# Altium project COMRAD_0v1.PrjPCB (part 4 of 5)

## Sheet Power_Distribution_TopLevel.SchDoc
size A4; DocumentNumber: 46; SheetNumber: 46; SheetTotal: 47
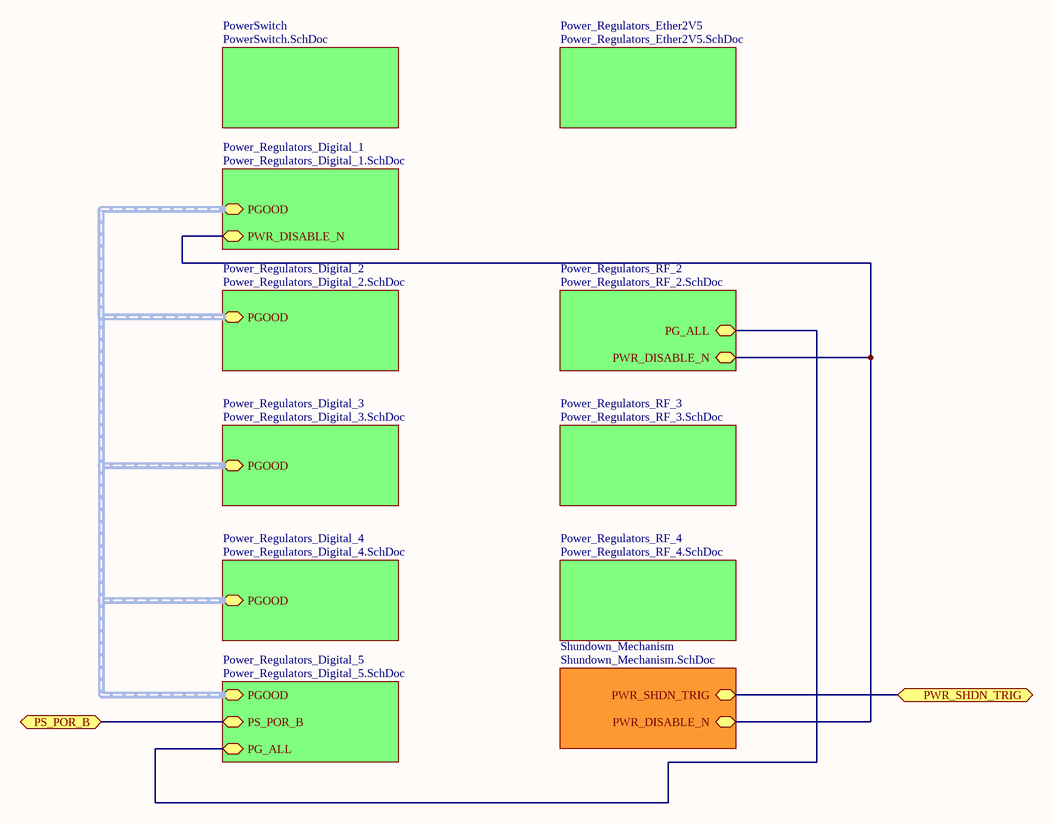
[diagram p30: Power_Distribution_TopLevel.SchDoc]

### Sub-sheets
Power_Regulators_Digital_1 = Power_Regulators_Digital_1.SchDoc: PGOOD (harness PGOOD), PWR_DISABLE_N (bidir)
Power_Regulators_Digital_2 = Power_Regulators_Digital_2.SchDoc: PGOOD (harness PGOOD)
Power_Regulators_Digital_3 = Power_Regulators_Digital_3.SchDoc: PGOOD (harness PGOOD)
Power_Regulators_Digital_4 = Power_Regulators_Digital_4.SchDoc: PGOOD (harness PGOOD)
Power_Regulators_Digital_5 = Power_Regulators_Digital_5.SchDoc: PGOOD (harness PGOOD), PS_POR_B (bidir), PG_ALL (bidir)
Power_Regulators_Ether2V5 = Power_Regulators_Ether2V5.SchDoc: no entries
Power_Regulators_RF_2 = Power_Regulators_RF_2.SchDoc: PG_ALL (bidir), PWR_DISABLE_N (bidir)
Power_Regulators_RF_3 = Power_Regulators_RF_3.SchDoc: no entries
Power_Regulators_RF_4 = Power_Regulators_RF_4.SchDoc: no entries
PowerSwitch = PowerSwitch.SchDoc: no entries
Shundown_Mechanism = Shundown_Mechanism.SchDoc: PWR_SHDN_TRIG, PWR_DISABLE_N (bidir)

### Ports
PS_POR_B (bidir), PWR_SHDN_TRIG (bidir)

### Nets
PGOOD_ALL: sheet Power_Regulators_Digital_5/PG_ALL, sheet Power_Regulators_RF_2/PG_ALL
PS_POR_B: port PS_POR_B, sheet Power_Regulators_Digital_5/PS_POR_B
NetR195_2: sheet Power_Regulators_Digital_1/PWR_DISABLE_N, sheet Power_Regulators_RF_2/PWR_DISABLE_N, sheet Shundown_Mechanism/PWR_DISABLE_N
NetR316_2: port PWR_SHDN_TRIG, sheet Shundown_Mechanism/PWR_SHDN_TRIG

### Buses and harness runs
harness sheet Power_Regulators_Digital_1/PGOOD = sheet Power_Regulators_Digital_2/PGOOD = sheet Power_Regulators_Digital_3/PGOOD = sheet Power_Regulators_Digital_4/PGOOD = sheet Power_Regulators_Digital_5/PGOOD

## Sheet PowerSwitch.SchDoc
size A4; DocumentNumber: 40; SheetNumber: 40; SheetTotal: 47
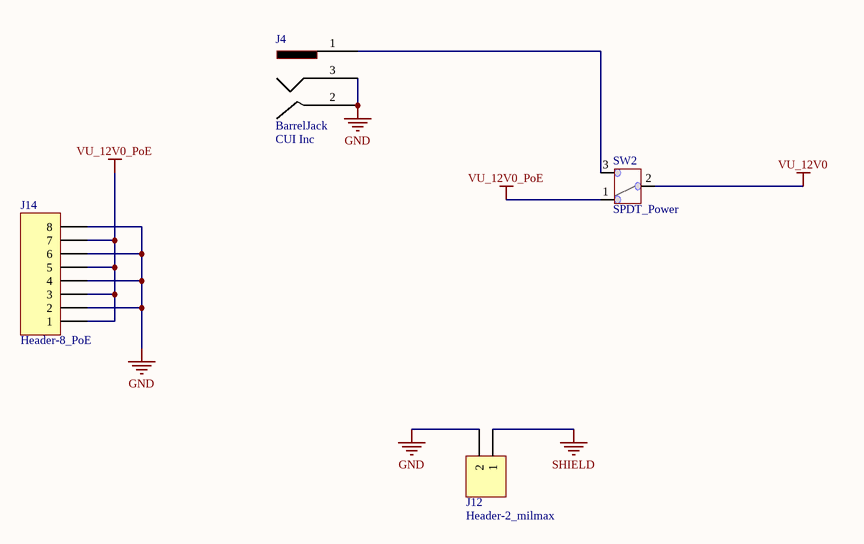
[diagram p31: PowerSwitch.SchDoc]

### Parts
J4  BarrelJack  Manufacturer: CUI Inc  [BarrelJack_PJ-028-SMT]
J12  Header-2_milmax  [Header_Mil-Max_800-10-002-40-002000_2-Pos]
J14  Header-8_PoE  [Header_FCI_20021221-00008T4LF_8-pos]
SW2  SPDT_Power  [SPDT_Power_L102021ML04Q_Thru-Hole]

### Nets
GND: J4.2 J4.3 J12.2 J14.2 J14.4 J14.6 J14.8
SHIELD: J12.1
VU_12V0: SW2.2
VU_12V0_PoE: J14.1 J14.3 J14.5 J14.7 SW2.1
NetJ4_1: J4.1 SW2.3

### Library data of the parts
J4 = PJ-028-SMT: CONN PWR JACK 0.8X3.35MM SMT; Part Number: PJ-028-SMT; Footprint Ref: BarrelJack_PJ-028-SMT; Library Ref: BarrelJack
J12 = 800-10-002-40-002000: CONN HEADER 2POS .100" HORIZ SMD; Manufacturer: Mill-Max Manufacturing Corp.; Part Number: 800-10-002-40-002000
J14 = 20021221-00008T4LF: CONN HEADER 8POS DUAL SHRD SMD; Manufacturer: FCI; Part Number: 20021221-00008T4LF
SW2 = L102021ML04Q: SWITCH SLIDE MINI SPDT R/A; Manufacturer: C&K Components; Value: 4A; Part Number: L102021ML04Q

## Sheet Power_Regulators_Digital_1.SchDoc
size A4; DocumentNumber: 30; SheetNumber: 30; SheetTotal: 47
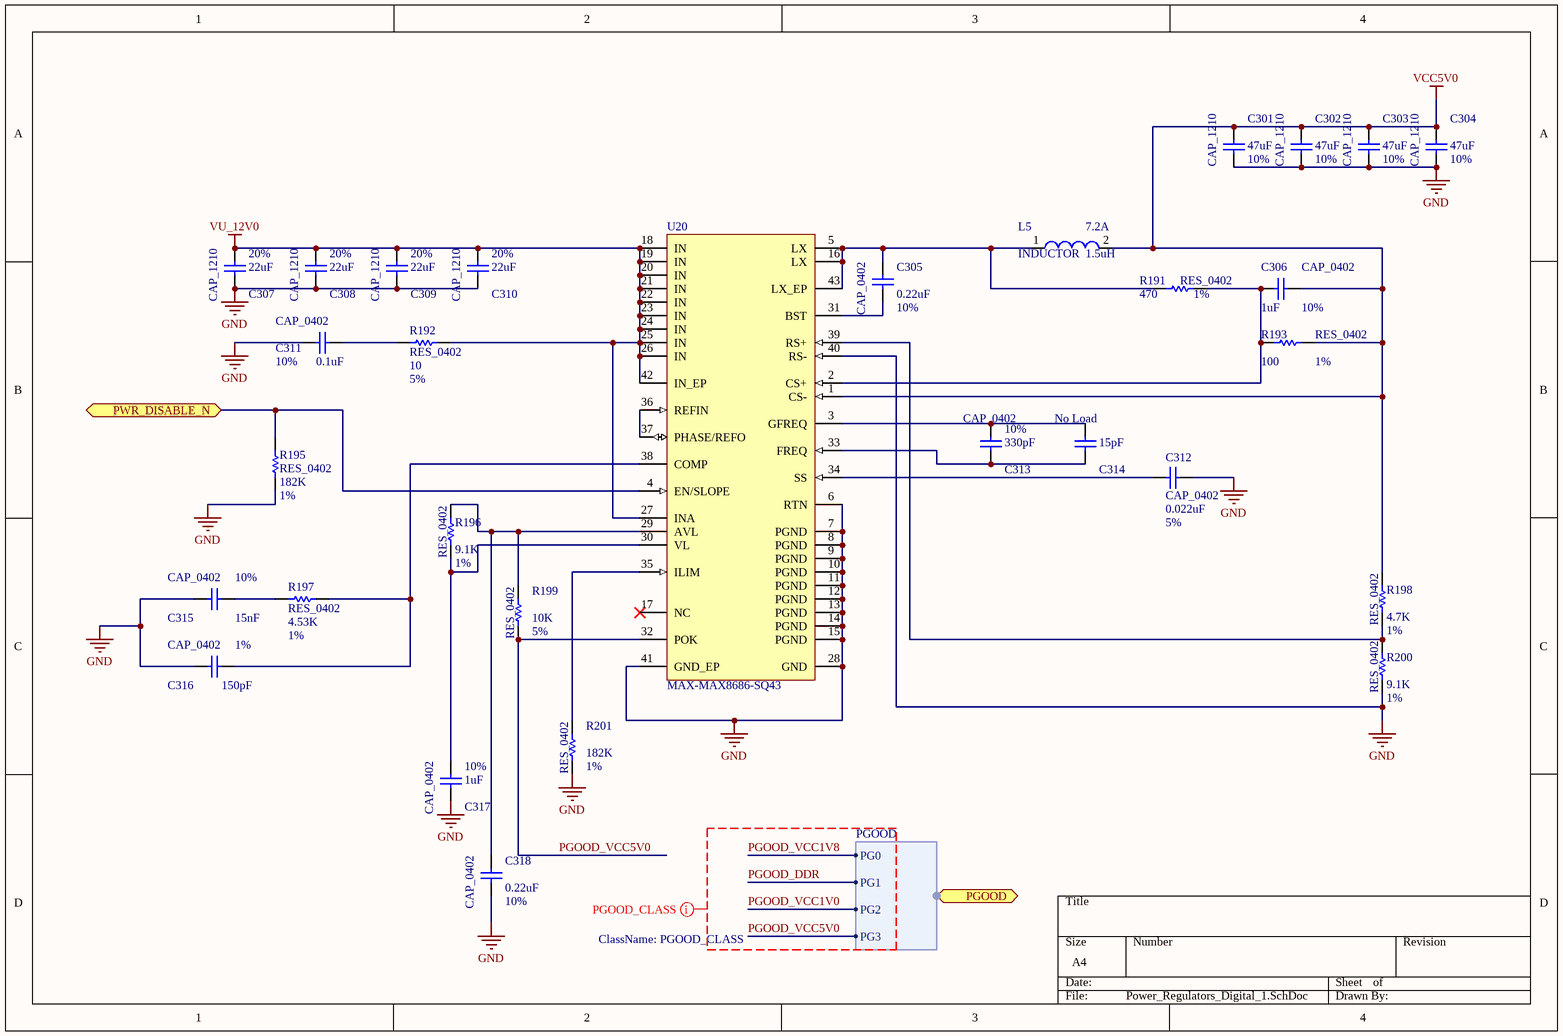
[diagram p32: Power_Regulators_Digital_1.SchDoc]

### Parts
C301  CAP_1210  value 47uF  Tolerance: 10%  [CAPC1210(3225)100_N]
C302  CAP_1210  value 47uF  Tolerance: 10%  [CAPC1210(3225)100_N]
C303  CAP_1210  value 47uF  Tolerance: 10%  [CAPC1210(3225)100_N]
C304  CAP_1210  value 47uF  Tolerance: 10%  [CAPC1210(3225)100_N]
C305  CAP_0402  value 0.22uF  Tolerance: 10%  [CAPC0402(1005)60_N]
C306  CAP_0402  value 1uF  Tolerance: 10%  [CAPC0402(1005)60_N]
C307  CAP_1210  value 22uF  Tolerance: 20%  [CAPC1210(3225)100_N]
C308  CAP_1210  value 22uF  Tolerance: 20%  [CAPC1210(3225)100_N]
C309  CAP_1210  value 22uF  Tolerance: 20%  [CAPC1210(3225)100_N]
C310  CAP_1210  value 22uF  Tolerance: 20%  [CAPC1210(3225)100_N]
C311  CAP_0402  value 0.1uF  Tolerance: 10%  [CAPC0402(1005)60_N]
C312  CAP_0402  value 0.022uF  Tolerance: 5%  [CAPC0402(1005)60_N]
C313  CAP_0402  value 330pF  Tolerance: 10%  [CAPC0402(1005)60_N]
C314  value 15pF  Manufacturer: No Load  [CAPC0201(0603)33_N]  (hidden comment: CAP_0201)
C315  CAP_0402  value 15nF  Tolerance: 10%  [CAPC0402(1005)60_N]
C316  CAP_0402  value 150pF  Tolerance: 1%  [CAPC0402(1005)60_N]
C317  CAP_0402  value 1uF  Tolerance: 10%  [CAPC0402(1005)60_N]
C318  CAP_0402  value 0.22uF  Tolerance: 10%  [CAPC0402(1005)60_N]
L5  INDUCTOR  value 1.5uH  Current: 7.2A  [Inductor_IHLP2020CZER1R5M01_2-PIN]
R191  RES_0402  value 470  Tolerance: 1%  [RESC0402(1005)_N]
R192  RES_0402  value 10  Tolerance: 5%  [RESC0402(1005)_N]
R193  RES_0402  value 100  Tolerance: 1%  [RESC0402(1005)_N]
R195  RES_0402  value 182K  Tolerance: 1%  [RESC0402(1005)_N]
R196  RES_0402  value 9.1K  Tolerance: 1%  [RESC0402(1005)_N]
R197  RES_0402  value 4.53K  Tolerance: 1%  [RESC0402(1005)_N]
R198  RES_0402  value 4.7K  Tolerance: 1%  [RESC0402(1005)_N]
R199  RES_0402  value 10K  Tolerance: 5%  [RESC0402(1005)_N]
R200  RES_0402  value 9.1K  Tolerance: 1%  [RESC0402(1005)_N]
R201  RES_0402  value 182K  Tolerance: 1%  [RESC0402(1005)_N]
U20  MAX-MAX8686-SQ43  [MAX_MAX8686_T4066M+1_N]

### Ports
PGOOD (harness PGOOD), PWR_DISABLE_N (bidir)

### Harnesses
PGOOD: PG0, PG1, PG2, PG3

### Nets
GND: C301.1 C302.1 C303.1 C304.1 C307.1 C308.1 C309.1 C310.1 C311.2 C312.2 C315.1 C316.2 C317.1 C318.1 R195.1 R200.1 R201.1 U20.6(RTN) U20.7(PGND) U20.8(PGND) U20.9(PGND) U20.10(PGND) U20.11(PGND) U20.12(PGND) U20.13(PGND) U20.14(PGND) U20.15(PGND) U20.28(GND) U20.40(RS-) U20.41(GND_EP)
VCC5V0: C301.2 C302.2 C303.2 C304.2 C306.2 L5.2 R193.2 R198.2 U20.1(CS-)
VU_12V0: C307.2 C308.2 C309.2 C310.2 R192.1 U20.18(IN) U20.19(IN) U20.20(IN) U20.21(IN) U20.22(IN) U20.23(IN) U20.24(IN) U20.25(IN) U20.26(IN) U20.27(INA) U20.42(IN_EP)
PGOOD_VCC5V0: R199.1 U20.32(POK) ; port PGOOD.PG3
NetC305_1: C305.1 U20.31(BST)
NetC305_2: C305.2 L5.1 R191.1 U20.5(LX) U20.16(LX) U20.43(LX_EP)
NetC306_1: C306.1 R191.2 R193.1 U20.2(CS+)
NetC311_1: C311.1 R192.2
NetC312_1: C312.1 U20.34(SS)
NetC313_1: C313.1 C314.1 U20.33(FREQ)
NetC313_2: C313.2 C314.2 U20.3(GFREQ)
NetC315_2: C315.2 R197.1
NetC316_1: C316.1 R197.2 U20.38(COMP)
NetC317_2: C317.2 R196.1 U20.30(VL)
NetC318_2: C318.2 R196.2 R199.2 U20.29(AVL)
NetR195_2: R195.2 U20.4(EN/SLOPE) ; port PWR_DISABLE_N
NetR198_1: R198.1 R200.2 U20.39(RS+)
NetR201_2: R201.2 U20.35(ILIM)
NetU20_36: U20.36(REFIN) U20.37(PHASE/REFO)

Not connected (* = marked no-connect by the designer): U20 17(NC)*

### Layout directives
net class PGOOD_CLASS: PGOOD_DDR, PGOOD_VCC1V0, PGOOD_VCC1V8, PGOOD_VCC5V0

### Library data of the parts
C301-C304 = GRM32ER71A476KE15L: 47uF, ceramic, 10% 10V X7R, 1210; Manufacturer: Murata Electronics North America; Part Number: GRM32ER71A476KE15L; Footprint Ref: CAPC1210(3225)100_N; Library Ref: CAP_1210
C305 C318 = 04026D224KAT2A: 0.22uF, ceramic, 10%, 6.3V X5R, 0402; Manufacturer: AVX Corporation; Part Number: 04026D224KAT2A; Footprint Ref: CAPC0402(1005)60_N; Library Ref: CAP_0402
C306 C317 = C1005X5R0J105K: 1uF, ceramic, 10%, 6.3V, X5R, 0402; Manufacturer: TDK Corporation; Part Number: C1005X5R0J105K; Footprint Ref: CAPC0402(1005)60_N; Library Ref: CAP_0402
C307-C310 = C1210C226M3RACTU: 22uF, ceramic, 20% 25V X7R, 1210; Manufacturer: Kemet; Part Number: C1210C226M3RACTU; Footprint Ref: CAPC1210(3225)100_N; Library Ref: CAP_1210
C311 = TMK105BJ104KV-F: 0.1uF, ceramic, 10%, 25V, X5R, 0402; Manufacturer: Taiyo Yuden; Part Number: TMK105BJ104KV-F; Footprint Ref: CAPC0402(1005)60_N; Library Ref: CAP_0402
C312 = 0402YC223JAT2A: 0.022uF, ceramic, 5% 16V X7R, 0402; Manufacturer: AVX Corporation; Part Number: 0402YC223JAT2A; Footprint Ref: CAPC0402(1005)60_N; Library Ref: CAP_0402
C313 = 0402ZC331KAT2A: 330pF, ceramic, 10% 10V X7R, 0402; Manufacturer: AVX Corporation; Part Number: 0402ZC331KAT2A; Footprint Ref: CAPC0402(1005)60_N; Library Ref: CAP_0402
C314 = No Load_15pF: Generic Capacitor; Tolerance: *; Part Number: No Load_15pF; Footprint Ref: CAPC0201(0603)33_N; Library Ref: CAP_0201
C315 = C0402C153K9PACTU: 0.015uF, ceramic, 10% 6.3V X5R, 0402; Manufacturer: Kemet; Part Number: C0402C153K9PACTU; Footprint Ref: CAPC0402(1005)60_N; Library Ref: CAP_0402
C316 = C1005C0G1H151F: 150pF, ceramic, 1% 50V NP0, 0402; Manufacturer: TDK Corporation; Part Number: C1005C0G1H151F; Footprint Ref: CAPC0402(1005)60_N; Library Ref: CAP_0402
L5 = IHLP2020CZER1R5M01: IHLP2020CZER1R5M01, 1.5uH 7.2A, SMD; Manufacturer: Vishay/Dale; Part Number: IHLP2020CZER1R5M01; Footprint Ref: Inductor_IHLP2020CZER1R5M01_2-PIN; Library Ref: INDUCTOR
R191 = RC0402FR-07470RL: 470 ohm, 1% 1/16W, 0402; Manufacturer: YAGEO; Part Number: RC0402FR-07470RL; Footprint Ref: RESC0402(1005)_N; Library Ref: RES_0402
R192 = RC0402JR-0710RL: 10 ohm, 5%, 1/16W, 0402; Manufacturer: Yageo America; Part Number: RC0402JR-0710RL; Footprint Ref: RESC0402(1005)_N; Library Ref: RES_0402
R193 = MCR01MZPF1000: 100 ohm, 1%, 1/16W, 0402; Manufacturer: ROHM; Part Number: MCR01MZPF1000; Footprint Ref: RESC0402(1005)_N; Library Ref: RES_0402
R195 R201 = ERJ-2RKF1823X: 182K ohm, 1%, 1/16W, 0402; Manufacturer: Panasonic - ECG; Part Number: ERJ-2RKF1823X; Footprint Ref: RESC0402(1005)_N; Library Ref: RES_0402
R196 R200 = ERJ-2RKF9101X: 9.1K ohm, 1% 1/10W, 0402; Manufacturer: Panasonic - ECG; Part Number: ERJ-2RKF9101X; Footprint Ref: RESC0402(1005)_N; Library Ref: RES_0402
R197 = ERJ-2RKF4531X: 4.53K ohm, 1%, 1/16W, 0402; Manufacturer: Panasonic - ECG; Part Number: ERJ-2RKF4531X; Footprint Ref: RESC0402(1005)_N; Library Ref: RES_0402
R198 = RC0402FR-074K7L: 4.7K ohm, 1%, 1/16W, 0402; Manufacturer: Yageo America; Part Number: RC0402FR-074K7L; Footprint Ref: RESC0402(1005)_N; Library Ref: RES_0402
R199 = RC0402JR-0710KL: 10K ohm, 5%, 1/16W, 0402; Manufacturer: Yageo America; Part Number: RC0402JR-0710KL; Footprint Ref: RESC0402(1005)_N; Library Ref: RES_0402
U20 = MAX8686ETL+: MAX8686ETL+, Buck Sync ADJ 25A, TQFP40-EP; Manufacturer: Maxim Integrated Products; Part Number: MAX8686ETL+

## Sheet Power_Regulators_Digital_2.SchDoc
size A4; DocumentNumber: 31; SheetNumber: 31; SheetTotal: 47
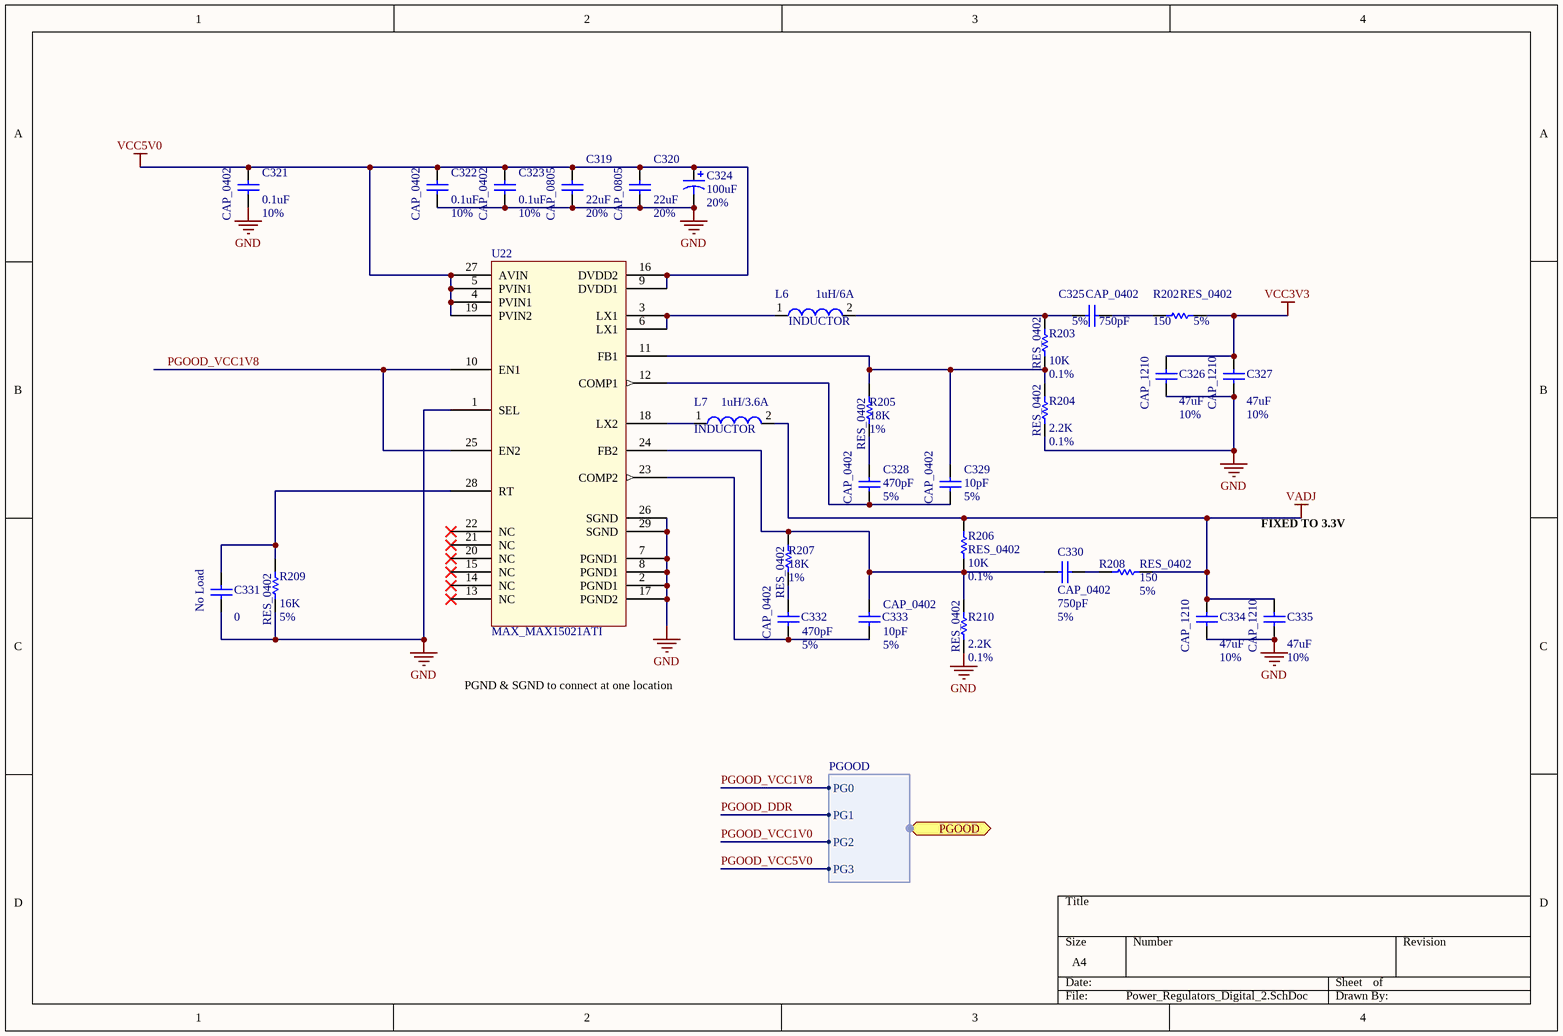
[diagram p33: Power_Regulators_Digital_2.SchDoc]

### Parts
C319  CAP_0805  value 22uF  Tolerance: 20%  [CAPC0805(2012)75_N]
C320  CAP_0805  value 22uF  Tolerance: 20%  [CAPC0805(2012)75_N]
C321  CAP_0402  value 0.1uF  Tolerance: 10%  [CAPC0402(1005)60_N]
C322  CAP_0402  value 0.1uF  Tolerance: 10%  [CAPC0402(1005)60_N]
C323  CAP_0402  value 0.1uF  Tolerance: 10%  [CAPC0402(1005)60_N]
C324  value 100uF  Tolerance: 20%  [Polarized_CAPC1210(3225)]  (hidden comment: Cap Pol1)
C325  CAP_0402  value 750pF  Tolerance: 5%  [CAPC0402(1005)60_N]
C326  CAP_1210  value 47uF  Tolerance: 10%  [CAPC1210(3225)100_N]
C327  CAP_1210  value 47uF  Tolerance: 10%  [CAPC1210(3225)100_N]
C328  CAP_0402  value 470pF  Tolerance: 5%  [CAPC0402(1005)60_N]
C329  CAP_0402  value 10pF  Tolerance: 5%  [CAPC0402(1005)60_N]
C330  CAP_0402  value 750pF  Tolerance: 5%  [CAPC0402(1005)60_N]
C331  value 0  Manufacturer: No Load  [CAPC0201(0603)33_N]  (hidden comment: CAP_0201)
C332  CAP_0402  value 470pF  Tolerance: 5%  [CAPC0402(1005)60_N]
C333  CAP_0402  value 10pF  Tolerance: 5%  [CAPC0402(1005)60_N]
C334  CAP_1210  value 47uF  Tolerance: 10%  [CAPC1210(3225)100_N]
C335  CAP_1210  value 47uF  Tolerance: 10%  [CAPC1210(3225)100_N]
L6  INDUCTOR  value 1uH/6A  [Inductor_SRN6045-Series_2-PIN]
L7  INDUCTOR  value 1uH/3.6A  [Inductor_NRS5020T1R0NMGJ_2-PIN]
R202  RES_0402  value 150  Tolerance: 5%  [RESC0402(1005)_N]
R203  RES_0402  value 10K  Tolerance: 0.1%  [RESC0402(1005)_N]
R204  RES_0402  value 2.2K  Tolerance: 0.1%  [RESC0402(1005)_N]
R205  RES_0402  value 18K  Tolerance: 1%  [RESC0402(1005)_N]
R206  RES_0402  value 10K  Tolerance: 0.1%  [RESC0402(1005)_N]
R207  RES_0402  value 18K  Tolerance: 1%  [RESC0402(1005)_N]
R208  RES_0402  value 150  Tolerance: 5%  [RESC0402(1005)_N]
R209  RES_0402  value 16K  Tolerance: 5%  [RESC0402(1005)_N]
R210  RES_0402  value 2.2K  Tolerance: 0.1%  [RESC0402(1005)_N]
U22  MAX_MAX15021ATI  [MAX_MAX15021ATI_28TQFN_T2855-6]

### Ports
PGOOD (harness PGOOD)

### Harnesses
PGOOD: PG0, PG1, PG2, PG3

### Nets
GND: C319.1 C320.1 C321.1 C322.1 C323.1 C324.2 C326.1 C327.1 C331.1 C334.1 C335.1 R204.1 R209.2 R210.1 U22.1(SEL) U22.2(PGND1) U22.7(PGND1) U22.8(PGND1) U22.17(PGND2) U22.26(SGND) U22.29(SGND)
VADJ: C334.2 C335.2 L7.2 R206.2 R208.2
VCC3V3: C326.2 C327.2 R202.2
VCC5V0: C319.2 C320.2 C321.2 C322.2 C323.2 C324.1 U22.4(PVIN1) U22.5(PVIN1) U22.9(DVDD1) U22.16(DVDD2) U22.19(PVIN2) U22.27(AVIN)
PGOOD_VCC1V8: U22.10(EN1) U22.25(EN2) ; port PGOOD.PG0
NetC325_1: C325.1 L6.2 R203.2
NetC325_2: C325.2 R202.1
NetC328_1: C328.1 C329.1 U22.12(COMP1)
NetC328_2: C328.2 R205.1
NetC329_2: C329.2 R203.1 R204.2 R205.2 U22.11(FB1)
NetC330_1: C330.1 C333.2 R206.1 R207.2 R210.2 U22.24(FB2)
NetC330_2: C330.2 R208.1
NetC331_2: C331.2 R209.1 U22.28(RT)
NetC332_1: C332.1 C333.1 U22.23(COMP2)
NetC332_2: C332.2 R207.1
NetL6_1: L6.1 U22.3(LX1) U22.6(LX1)
NetL7_1: L7.1 U22.18(LX2)

Not connected (* = marked no-connect by the designer): U22 13(NC)* 14(NC)* 15(NC)* 20(NC)* 21(NC)* 22(NC)*

### Notes on the sheet
- FIXED TO 3.3V
- PGND & SGND to connect at one location

### Library data of the parts
C319 C320 = JMK212BJ226MG-T: 22uF, ceramic, 20%, 6.3V, X5R, 0805; Manufacturer: Taiyo Yuden; Part Number: JMK212BJ226MG-T; Footprint Ref: CAPC0805(2012)75_N; Library Ref: CAP_0805
C321-C323 = C1005X5R0J104K: 0.1uf, ceramic, 10%, 6.3V, X5R, 0402; Manufacturer: TDK Corporation; Part Number: C1005X5R0J104K; Footprint Ref: CAPC0402(1005)60_N; Library Ref: CAP_0402
C324 = TLCT107M010XTA: 100uF, tantalum, 20% 10V, 1210; Manufacturer: AVX Corporation; Part Number: TLCT107M010XTA; Footprint Ref: Polarized_CAPC1210(3225); Library Ref: Cap Pol1
C325 C330 = C0402C751J3GACTU: 750pF, ceramic, 5% 25V NP0, 0402; Manufacturer: Kemet; Part Number: C0402C751J3GACTU; Footprint Ref: CAPC0402(1005)60_N; Library Ref: CAP_0402
C326 C327 C334 C335 = GRM32ER61A476KE20L: 47uF, ceramic 10% 10V, X5R, 1210; Manufacturer: Murata Electronics North America; Part Number: GRM32ER61A476KE20L; Footprint Ref: CAPC1210(3225)100_N; Library Ref: CAP_1210
C328 C332 = ECJ-0EB1E471K: 470pF, ceramic, 5%, 25V, X7R, 0402; Manufacturer: Panasonic-ECG; Part Number: ECJ-0EB1E471K; Footprint Ref: CAPC0402(1005)60_N; Library Ref: CAP_0402
C329 C333 = VJ0402A100JXACW1BC: 10pF, ceramic, 5%, 50V, NP0, 0402; Manufacturer: BC COMPONENTS; Part Number: VJ0402A100JXACW1BC; Footprint Ref: CAPC0402(1005)60_N; Library Ref: CAP_0402
C331 = No Load_0: Generic Capacitor; Tolerance: *; Part Number: No Load_0; Footprint Ref: CAPC0201(0603)33_N; Library Ref: CAP_0201
L6 = SRN6045-1R0Y: SRN6045-1R0Y, 1uH 4.2A-8.5A, CDRH6D38; Manufacturer: Bourns; Tolerance: *; Part Number: SRN6045-1R0Y; Footprint Ref: Inductor_SRN6045-Series_2-PIN; Library Ref: INDUCTOR
L7 = NRS5020T1R0NMGJ: NRS5020T1R0NMGJ, 1uH 3.6A, 5020; Manufacturer: Taiyo Yuden; Tolerance: *; Part Number: NRS5020T1R0NMGJ; Footprint Ref: Inductor_NRS5020T1R0NMGJ_2-PIN; Library Ref: INDUCTOR
R202 R208 = RC0402JR-07150RL: 150 ohm, 5% 1/16W, 0402; Manufacturer: Yageo America; Part Number: RC0402JR-07150RL; Footprint Ref: RESC0402(1005)_N; Library Ref: RES_0402
R203 R206 = ERA-2AEB103X: 10K ohm, 0.1% 1/16W, 0402; Manufacturer: Panasonic - ECG; Part Number: ERA-2AEB103X; Footprint Ref: RESC0402(1005)_N; Library Ref: RES_0402
R204 R210 = ERA-2AEB222X: 2.2K ohm, 0.1% 1/16W, 0402; Manufacturer: Panasonic - ECG; Part Number: ERA-2AEB222X; Footprint Ref: RESC0402(1005)_N; Library Ref: RES_0402
R205 R207 = MCR01MZPF1802: 18K ohm, 1% 1/16W, 0402; Manufacturer: ROHM; Part Number: MCR01MZPF1802; Footprint Ref: RESC0402(1005)_N; Library Ref: RES_0402
R209 = CRCW040216K0JNED: 16K ohm, 5% 1/16W, 0402; Manufacturer: Vishay/Dale; Part Number: CRCW040216K0JNED; Footprint Ref: RESC0402(1005)_N; Library Ref: RES_0402
U22 = MAX15021ATI+: MAX15021ATI, 4A/2A, 4MHz, Step-Down DC-DC Regulator, TQFN28; Manufacturer: Maxim Integrated Products; Part Number: MAX15021ATI+

## Sheet Power_Regulators_Digital_3.SchDoc
size A4; DocumentNumber: 32; SheetNumber: 32; SheetTotal: 47
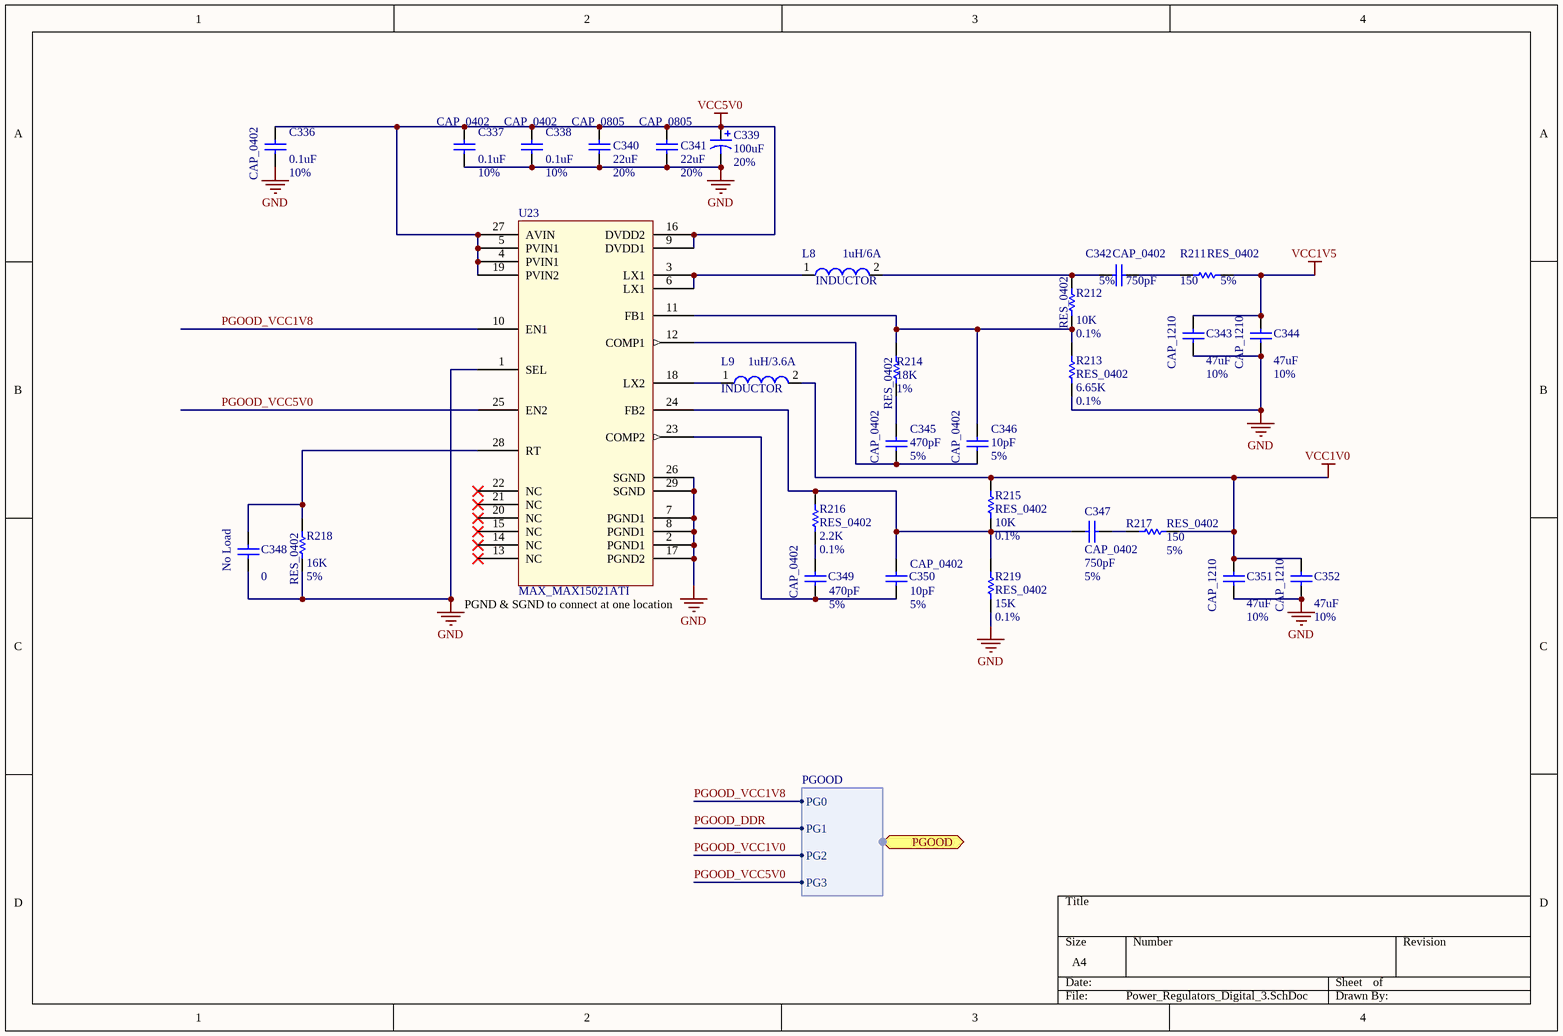
[diagram p34: Power_Regulators_Digital_3.SchDoc]

### Parts
C336  CAP_0402  value 0.1uF  Tolerance: 10%  [CAPC0402(1005)60_N]
C337  CAP_0402  value 0.1uF  Tolerance: 10%  [CAPC0402(1005)60_N]
C338  CAP_0402  value 0.1uF  Tolerance: 10%  [CAPC0402(1005)60_N]
C339  value 100uF  Tolerance: 20%  [Polarized_CAPC1210(3225)]  (hidden comment: Cap Pol1)
C340  CAP_0805  value 22uF  Tolerance: 20%  [CAPC0805(2012)75_N]
C341  CAP_0805  value 22uF  Tolerance: 20%  [CAPC0805(2012)75_N]
C342  CAP_0402  value 750pF  Tolerance: 5%  [CAPC0402(1005)60_N]
C343  CAP_1210  value 47uF  Tolerance: 10%  [CAPC1210(3225)100_N]
C344  CAP_1210  value 47uF  Tolerance: 10%  [CAPC1210(3225)100_N]
C345  CAP_0402  value 470pF  Tolerance: 5%  [CAPC0402(1005)60_N]
C346  CAP_0402  value 10pF  Tolerance: 5%  [CAPC0402(1005)60_N]
C347  CAP_0402  value 750pF  Tolerance: 5%  [CAPC0402(1005)60_N]
C348  value 0  Manufacturer: No Load  [CAPC0201(0603)33_N]  (hidden comment: CAP_0201)
C349  CAP_0402  value 470pF  Tolerance: 5%  [CAPC0402(1005)60_N]
C350  CAP_0402  value 10pF  Tolerance: 5%  [CAPC0402(1005)60_N]
C351  CAP_1210  value 47uF  Tolerance: 10%  [CAPC1210(3225)100_N]
C352  CAP_1210  value 47uF  Tolerance: 10%  [CAPC1210(3225)100_N]
L8  INDUCTOR  value 1uH/6A  [Inductor_SRN6045-Series_2-PIN]
L9  INDUCTOR  value 1uH/3.6A  [Inductor_NRS5020T1R0NMGJ_2-PIN]
R211  RES_0402  value 150  Tolerance: 5%  [RESC0402(1005)_N]
R212  RES_0402  value 10K  Tolerance: 0.1%  [RESC0402(1005)_N]
R213  RES_0402  value 6.65K  Tolerance: 0.1%  [RESC0402(1005)_N]
R214  RES_0402  value 18K  Tolerance: 1%  [RESC0402(1005)_N]
R215  RES_0402  value 10K  Tolerance: 0.1%  [RESC0402(1005)_N]
R216  RES_0402  value 2.2K  Tolerance: 0.1%  [RESC0402(1005)_N]
R217  RES_0402  value 150  Tolerance: 5%  [RESC0402(1005)_N]
R218  RES_0402  value 16K  Tolerance: 5%  [RESC0402(1005)_N]
R219  RES_0402  value 15K  Tolerance: 0.1%  [RESC0402(1005)_N]
U23  MAX_MAX15021ATI  [MAX_MAX15021ATI_28TQFN_T2855-6]

### Ports
PGOOD (harness PGOOD)

### Harnesses
PGOOD: PG0, PG1, PG2, PG3

### Nets
GND: C336.1 C337.1 C338.1 C339.2 C340.1 C341.1 C343.1 C344.1 C348.1 C351.1 C352.1 R213.1 R218.2 R219.1 U23.1(SEL) U23.2(PGND1) U23.7(PGND1) U23.8(PGND1) U23.17(PGND2) U23.26(SGND) U23.29(SGND)
VCC1V0: C351.2 C352.2 L9.2 R215.2 R217.2
VCC1V5: C343.2 C344.2 R211.2
VCC5V0: C336.2 C337.2 C338.2 C339.1 C340.2 C341.2 U23.4(PVIN1) U23.5(PVIN1) U23.9(DVDD1) U23.16(DVDD2) U23.19(PVIN2) U23.27(AVIN)
PGOOD_VCC1V8: U23.10(EN1) ; port PGOOD.PG0
PGOOD_VCC5V0: U23.25(EN2) ; port PGOOD.PG3
NetC342_1: C342.1 L8.2 R212.2
NetC342_2: C342.2 R211.1
NetC345_1: C345.1 C346.1 U23.12(COMP1)
NetC345_2: C345.2 R214.1
NetC346_2: C346.2 R212.1 R213.2 R214.2 U23.11(FB1)
NetC347_1: C347.1 C350.2 R215.1 R216.2 R219.2 U23.24(FB2)
NetC347_2: C347.2 R217.1
NetC348_2: C348.2 R218.1 U23.28(RT)
NetC349_1: C349.1 C350.1 U23.23(COMP2)
NetC349_2: C349.2 R216.1
NetL8_1: L8.1 U23.3(LX1) U23.6(LX1)
NetL9_1: L9.1 U23.18(LX2)

Not connected (* = marked no-connect by the designer): U23 13(NC)* 14(NC)* 15(NC)* 20(NC)* 21(NC)* 22(NC)*

### Notes on the sheet
- (near U23) PGND & SGND to connect at one location

### Library data of the parts
C336-C338 = C1005X5R0J104K: as C321 on sheet Power_Regulators_Digital_2; Part Number: C1005X5R0J104K; Footprint Ref: CAPC0402(1005)60_N; Library Ref: CAP_0402
C339 = TLCT107M010XTA: as C324 on sheet Power_Regulators_Digital_2; Part Number: TLCT107M010XTA; Footprint Ref: Polarized_CAPC1210(3225); Library Ref: Cap Pol1
C340 C341 = JMK212BJ226MG-T: as C319 on sheet Power_Regulators_Digital_2; Part Number: JMK212BJ226MG-T; Footprint Ref: CAPC0805(2012)75_N; Library Ref: CAP_0805
C342 C347 = C0402C751J3GACTU: as C325 on sheet Power_Regulators_Digital_2; Part Number: C0402C751J3GACTU; Footprint Ref: CAPC0402(1005)60_N; Library Ref: CAP_0402
C343 C344 C351 C352 = GRM32ER61A476KE20L: as C326 on sheet Power_Regulators_Digital_2; Part Number: GRM32ER61A476KE20L; Footprint Ref: CAPC1210(3225)100_N; Library Ref: CAP_1210
C345 C349 = ECJ-0EB1E471K: as C328 on sheet Power_Regulators_Digital_2; Part Number: ECJ-0EB1E471K; Footprint Ref: CAPC0402(1005)60_N; Library Ref: CAP_0402
C346 C350 = VJ0402A100JXACW1BC: as C329 on sheet Power_Regulators_Digital_2; Part Number: VJ0402A100JXACW1BC; Footprint Ref: CAPC0402(1005)60_N; Library Ref: CAP_0402
C348 = No Load_0: Generic Capacitor; Tolerance: *; Part Number: No Load_0; Footprint Ref: CAPC0201(0603)33_N; Library Ref: CAP_0201
L8 = SRN6045-1R0Y: as L6 on sheet Power_Regulators_Digital_2; Tolerance: *; Part Number: SRN6045-1R0Y; Footprint Ref: Inductor_SRN6045-Series_2-PIN; Library Ref: INDUCTOR
L9 = NRS5020T1R0NMGJ: as L7 on sheet Power_Regulators_Digital_2; Tolerance: *; Part Number: NRS5020T1R0NMGJ; Footprint Ref: Inductor_NRS5020T1R0NMGJ_2-PIN; Library Ref: INDUCTOR
R211 R217 = RC0402JR-07150RL: as R202 on sheet Power_Regulators_Digital_2; Part Number: RC0402JR-07150RL; Footprint Ref: RESC0402(1005)_N; Library Ref: RES_0402
R212 R215 = ERA-2AEB103X: as R203 on sheet Power_Regulators_Digital_2; Part Number: ERA-2AEB103X; Footprint Ref: RESC0402(1005)_N; Library Ref: RES_0402
R213 = 2-1879215-2: 6.65K ohm, 0.1% 1/16W, 0402; Manufacturer: TE Connectivity; Part Number: 2-1879215-2; Footprint Ref: RESC0402(1005)_N; Library Ref: RES_0402
R214 = MCR01MZPF1802: as R205 on sheet Power_Regulators_Digital_2; Part Number: MCR01MZPF1802; Footprint Ref: RESC0402(1005)_N; Library Ref: RES_0402
R216 = ERA-2AEB222X: as R204 on sheet Power_Regulators_Digital_2; Part Number: ERA-2AEB222X; Footprint Ref: RESC0402(1005)_N; Library Ref: RES_0402
R218 = CRCW040216K0JNED: as R209 on sheet Power_Regulators_Digital_2; Part Number: CRCW040216K0JNED; Footprint Ref: RESC0402(1005)_N; Library Ref: RES_0402
R219 = ERA-2AEB153X: 15K ohm, 0.1% 1/16W, 0402; Manufacturer: Panasonic - ECG; Part Number: ERA-2AEB153X; Footprint Ref: RESC0402(1005)_N; Library Ref: RES_0402
U23 = MAX15021ATI+: as U22 on sheet Power_Regulators_Digital_2; Part Number: MAX15021ATI+

## Sheet Power_Regulators_Digital_4.SchDoc
size A4; DocumentNumber: 33; SheetNumber: 33; SheetTotal: 47
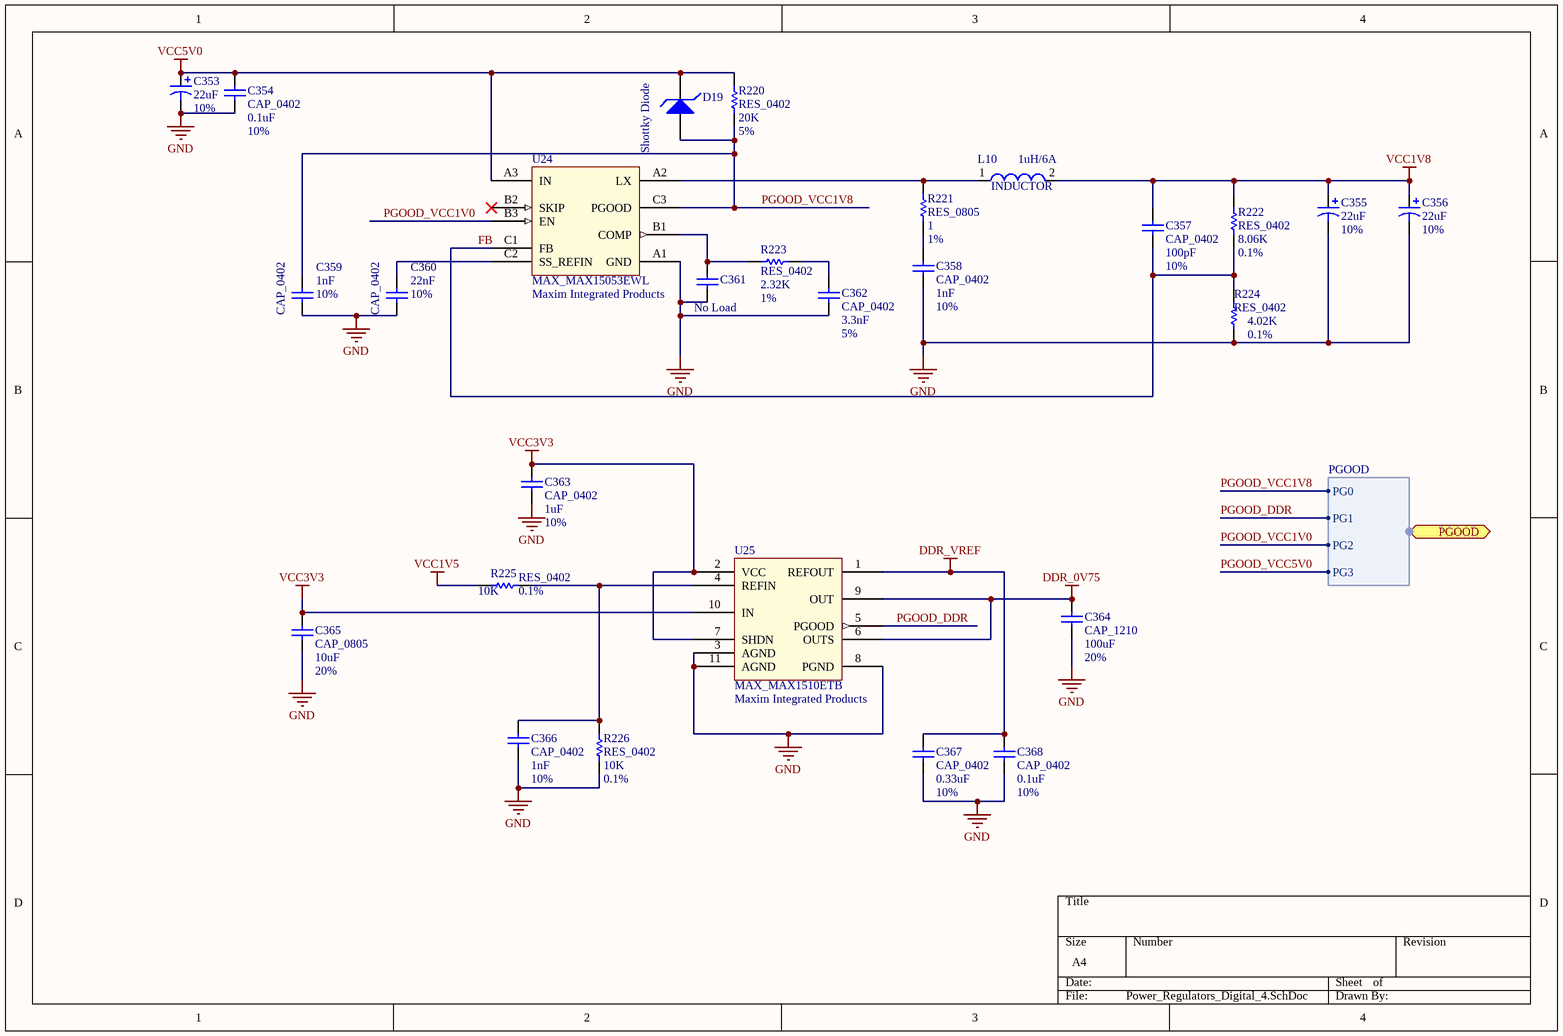
[diagram p35: Power_Regulators_Digital_4.SchDoc]

### Parts
C353  value 22uF  Tolerance: 10%  [Polarized_CAPC1210(3225)]  (hidden comment: Cap Pol1)
C354  CAP_0402  value 0.1uF  Tolerance: 10%  [CAPC0402(1005)60_N]
C355  value 22uF  Tolerance: 10%  [Polarized_CAPC1210(3225)]  (hidden comment: Cap Pol1)
C356  value 22uF  Tolerance: 10%  [Polarized_CAPC1210(3225)]  (hidden comment: Cap Pol1)
C357  CAP_0402  value 100pF  Tolerance: 10%  [CAPC0402(1005)60_N]
C358  CAP_0402  value 1nF  Tolerance: 10%  [CAPC0402(1005)60_N]
C359  CAP_0402  value 1nF  Tolerance: 10%  [CAPC0402(1005)60_N]
C360  CAP_0402  value 22nF  Tolerance: 10%  [CAPC0402(1005)60_N]
C361  value No Load  [CAPC0201(0603)33_N]  (hidden comment: CAP_0201)
C362  CAP_0402  value 3.3nF  Tolerance: 5%  [CAPC0402(1005)60_N]
C363  CAP_0402  value 1uF  Tolerance: 10%  [CAPC0402(1005)60_N]
C364  CAP_1210  value 100uF  Tolerance: 20%  [CAPC1210(3225)100_N]
C365  CAP_0805  value 10uF  Tolerance: 20%  [CAPC0805(2012)75_N]
C366  CAP_0402  value 1nF  Tolerance: 10%  [CAPC0402(1005)60_N]
C367  CAP_0402  value 0.33uF  Tolerance: 10%  [CAPC0402(1005)60_N]
C368  CAP_0402  value 0.1uF  Tolerance: 10%  [CAPC0402(1005)60_N]
D19  Shottky Diode  [SchottkyDiode_RB751S40_2-PIN]
L10  INDUCTOR  value 1uH/6A  [Inductor_SRN6045-Series_2-PIN]
R220  RES_0402  value 20K  Tolerance: 5%  [RESC0402(1005)_N]
R221  RES_0805  value 1  Tolerance: 1%  [RESC0805(2012)_N]
R222  RES_0402  value 8.06K  Tolerance: 0.1%  [RESC0402(1005)_N]
R223  RES_0402  value 2.32K  Tolerance: 1%  [RESC0402(1005)_N]
R224  RES_0402  value 4.02K  Tolerance: 0.1%  [RESC0402(1005)_N]
R225  RES_0402  value 10K  Tolerance: 0.1%  [RESC0402(1005)_N]
R226  RES_0402  value 10K  Tolerance: 0.1%  [RESC0402(1005)_N]
U24  MAX_MAX15053EWL  Manufacturer: Maxim Integrated Products  [MAX_MAX15053EWL_9WLP_W91E1Z+1]
U25  MAX_MAX1510ETB  Manufacturer: Maxim Integrated Products  [MAX_MAX1510ETB_10TDFN_T1033+1]

### Ports
PGOOD (harness PGOOD)

### Harnesses
PGOOD: PG0, PG1, PG2, PG3

### Nets
DDR_0V75: C364.2 U25.6(OUTS) U25.9(OUT)
DDR_VREF: C367.2 C368.2 U25.1(REFOUT)
GND: C353.2 C354.1 C355.2 C356.2 C358.1 C359.1 C360.1 C361.1 C362.1 C363.1 C364.1 C365.1 C366.1 C367.1 C368.1 R224.1 R226.1 U24.A1(GND) U25.3(AGND) U25.8(PGND) U25.11(AGND)
VCC1V5: R225.1
VCC1V8: C355.1 C356.1 C357.2 L10.2 R222.2  [project net A_VCC1V8]
VCC3V3: C363.2 C365.2 U25.2(VCC) U25.7(SHDN) U25.10(IN)
VCC5V0: C353.1 C354.2 D19.1(K) R220.2 U24.A3(IN)
FB: C357.1 R222.1 R224.2 U24.C1(FB)
PGOOD_DDR: U25.5(PGOOD) ; port PGOOD.PG1
PGOOD_VCC1V0: U24.B3(EN) ; port PGOOD.PG2
PGOOD_VCC1V8: C359.2 D19.2(A) R220.1 U24.C3(PGOOD) ; port PGOOD.PG0
NetC358_2: C358.2 R221.1
NetC360_2: C360.2 U24.C2(SS_REFIN)
NetC361_2: C361.2 R223.1 U24.B1(COMP)
NetC362_2: C362.2 R223.2
NetC366_2: C366.2 R225.2 R226.2 U25.4(REFIN)
NetL10_1: L10.1 R221.2 U24.A2(LX)

Not connected (* = marked no-connect by the designer): U24 B2(SKIP)*

### Library data of the parts
C353 C355 C356 = TAJB226K006RNJ: 22uF, tantalum, 10% 6.3V, 1210; Manufacturer: AVX Corporation; Part Number: TAJB226K006RNJ; Footprint Ref: Polarized_CAPC1210(3225); Library Ref: Cap Pol1
C354 C368 = C1005X5R0J104K: as C321 on sheet Power_Regulators_Digital_2; Part Number: C1005X5R0J104K; Footprint Ref: CAPC0402(1005)60_N; Library Ref: CAP_0402
C357 = 04026C101KAT2A: 100pF, ceramic, 10% 6.3V X7R, 0402; Manufacturer: AVX Corporation; Part Number: 04026C101KAT2A; Footprint Ref: CAPC0402(1005)60_N; Library Ref: CAP_0402
C358 C359 C366 = ECJ-0EB1E102K: 1000pF, ceramic, 10% 25V X7R, 0402; Manufacturer: Panasonic - ECG; Part Number: ECJ-0EB1E102K; Footprint Ref: CAPC0402(1005)60_N; Library Ref: CAP_0402
C360 = 0402YC223KAT2A: 0.022uF, ceramic, 10%, 16V, X7R, 0402; Manufacturer: AVX Corporation; Part Number: 0402YC223KAT2A; Footprint Ref: CAPC0402(1005)60_N; Library Ref: CAP_0402
C361 = No Load: Generic Capacitor; Tolerance: *; Part Number: No Load; Manufacturer: No Load; Footprint Ref: CAPC0201(0603)33_N; Library Ref: CAP_0201
C362 = LMK105SD332JV-F: 3300pF, ceramic 5% 10V, 0402; Manufacturer: Taiyo Yuden; Part Number: LMK105SD332JV-F; Footprint Ref: CAPC0402(1005)60_N; Library Ref: CAP_0402
C363 = C1005X5R0J105K: as C306 on sheet Power_Regulators_Digital_1; Part Number: C1005X5R0J105K; Footprint Ref: CAPC0402(1005)60_N; Library Ref: CAP_0402
C364 = GRM32ER60J107ME20L: 100uF, ceramic, 20% 6.3V X5R, 1210; Manufacturer: Murata Electronics North America; Part Number: GRM32ER60J107ME20L; Footprint Ref: CAPC1210(3225)100_N; Library Ref: CAP_1210
C365 = ECJ-2FB0J106M: 10uF, ceramic, 20%, 6.3V, X5R 0805; Manufacturer: Panasonic - ECG; Part Number: ECJ-2FB0J106M; Footprint Ref: CAPC0805(2012)75_N; Library Ref: CAP_0805
C367 = C1005X5R1C334K: 0.33uF, ceramic, 10% 16V X5R, 0402; Manufacturer: TDK Corporation; Part Number: C1005X5R1C334K; Footprint Ref: CAPC0402(1005)60_N; Library Ref: CAP_0402
D19 = RB751S40: RB751S40, 40V 30mA schottky, SOD523F; Manufacturer: FAIRCHILD SEMICONDUCTOR; Part Number: RB751S40; Footprint Ref: SchottkyDiode_RB751S40_2-PIN; Library Ref: ShottkyDiode
L10 = SRN6045-1R0Y: as L6 on sheet Power_Regulators_Digital_2; Tolerance: *; Part Number: SRN6045-1R0Y; Footprint Ref: Inductor_SRN6045-Series_2-PIN; Library Ref: INDUCTOR
R220 = ERJ-2GEJ203X: 20K ohm, 5%, 1/16W, 0402; Manufacturer: Panasonic - ECG; Part Number: ERJ-2GEJ203X; Footprint Ref: RESC0402(1005)_N; Library Ref: RES_0402
R221 = MCR10EZHFL1R00: 1 ohm, 1% 1/4W, 0805; Manufacturer: ROHM; Part Number: MCR10EZHFL1R00; Footprint Ref: RESC0805(2012)_N; Library Ref: RES_0805
R222 = 2-1879215-9: 8.06K ohm, 0.1% 1/16W, 0402; Manufacturer: TE Connectivity; Part Number: 2-1879215-9; Footprint Ref: RESC0402(1005)_N; Library Ref: RES_0402
R223 = ERJ-2RKF2321X: 2.32K ohm, 1% 1/16W, 0402; Manufacturer: Panasonic - ECG; Part Number: ERJ-2RKF2321X; Footprint Ref: RESC0402(1005)_N; Library Ref: RES_0402
R224 = RG1005P-4021-B-T5: 4.02K ohm, 0.1% 1/16W, 0402; Manufacturer: Susumu Co Ltd; Part Number: RG1005P-4021-B-T5; Footprint Ref: RESC0402(1005)_N; Library Ref: RES_0402
R225 R226 = ERA-2AEB103X: as R203 on sheet Power_Regulators_Digital_2; Part Number: ERA-2AEB103X; Footprint Ref: RESC0402(1005)_N; Library Ref: RES_0402
U24 = MAX15053EWL+T: MAX15053EWL, 2A, Current-Mode Synchronous, Step-Down reg, WLP9; Part Number: MAX15053EWL+T; Footprint Ref: MAX_MAX15053EWL_9WLP_W91E1Z+1; Library Ref: MAX_MAX15053EWL
U25 = MAX1510ETB+T: MAX1510ETB, Low-Voltage, DDR Linear Regulators, DFN10; Part Number: MAX1510ETB+T; Footprint Ref: MAX_MAX1510ETB_10TDFN_T1033+1; Library Ref: MAX_MAX1510ETB

## Sheet Power_Regulators_Digital_5.SchDoc
size A4; DocumentNumber: 34; SheetNumber: 34; SheetTotal: 47
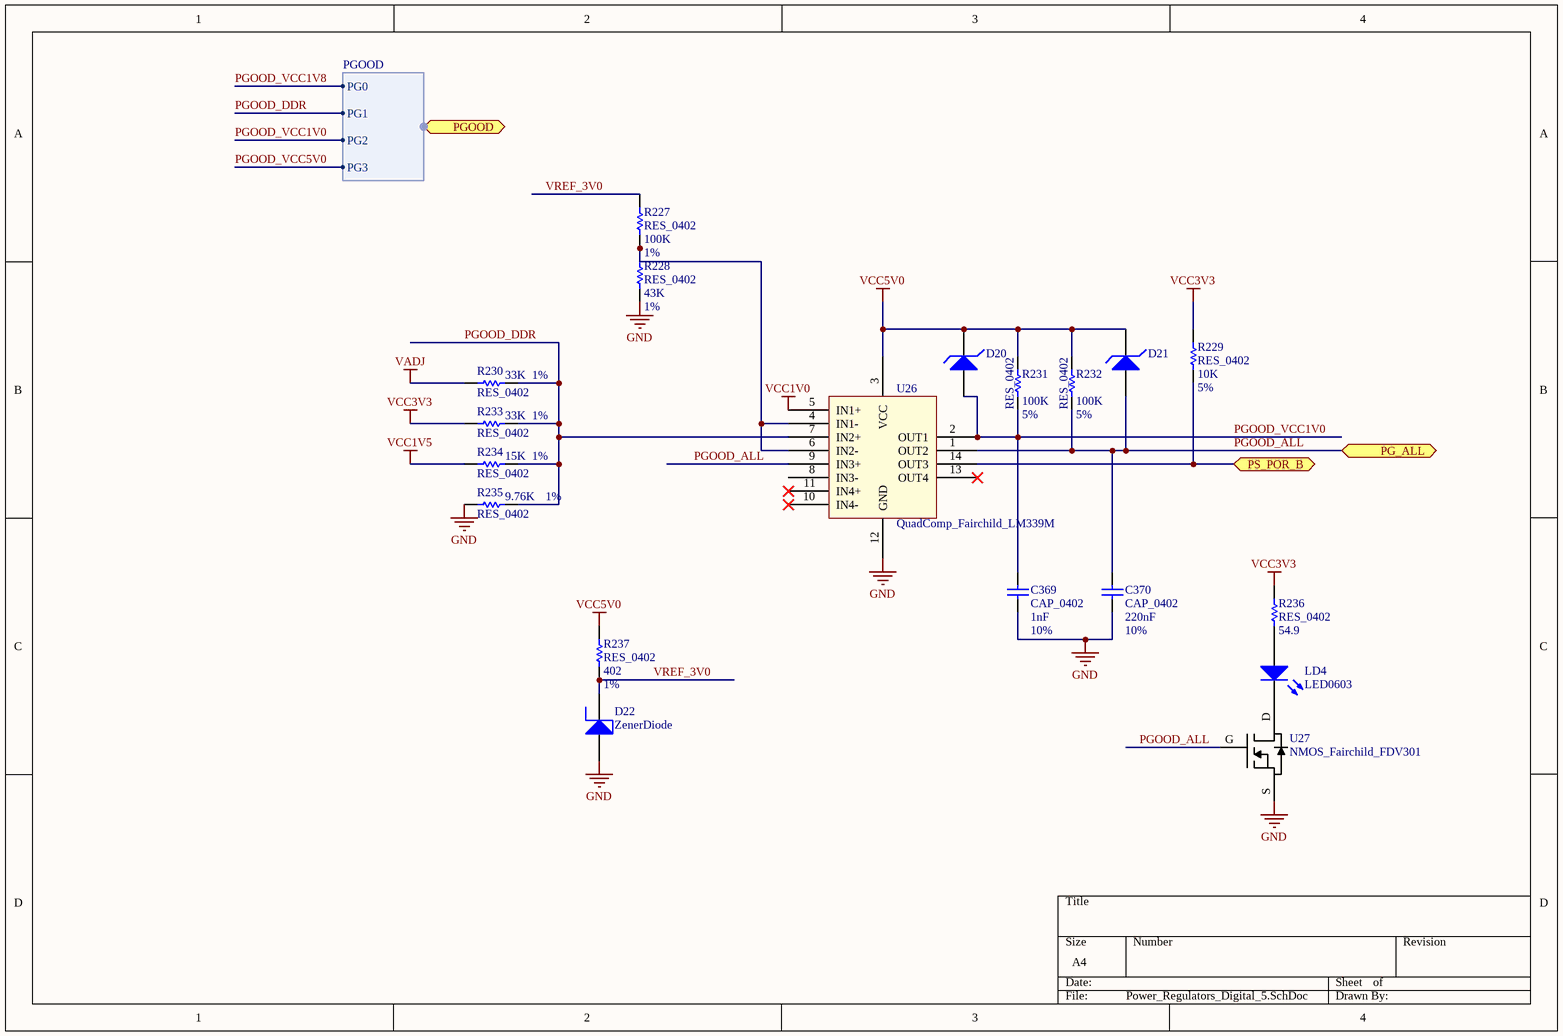
[diagram p36: Power_Regulators_Digital_5.SchDoc]

### Parts
C369  CAP_0402  value 1nF  Tolerance: 10%  [CAPC0402(1005)60_N]
C370  CAP_0402  value 220nF  Tolerance: 10%  [CAPC0402(1005)60_N]
D20  Shottky Diode  [SchottkyDiode_RB751S40_2-PIN]  (value not drawn)
D21  Shottky Diode  [SchottkyDiode_RB751S40_2-PIN]  (value not drawn)
D22  ZenerDiode  [ZenerDiode_BZX84-A3V0215_SOT23-3]
LD4  LED0603  [LED0603(1608)_HSMG-C190]
R227  RES_0402  value 100K  Tolerance: 1%  [RESC0402(1005)_N]
R228  RES_0402  value 43K  Tolerance: 1%  [RESC0402(1005)_N]
R229  RES_0402  value 10K  Tolerance: 5%  [RESC0402(1005)_N]
R230  RES_0402  value 33K  Tolerance: 1%  [RESC0402(1005)_N]
R231  RES_0402  value 100K  Tolerance: 5%  [RESC0402(1005)_N]
R232  RES_0402  value 100K  Tolerance: 5%  [RESC0402(1005)_N]
R233  RES_0402  value 33K  Tolerance: 1%  [RESC0402(1005)_N]
R234  RES_0402  value 15K  Tolerance: 1%  [RESC0402(1005)_N]
R235  RES_0402  value 9.76K  Tolerance: 1%  [RESC0402(1005)_N]
R236  RES_0402  value 54.9  [RESC0402(1005)_N]
R237  RES_0402  value 402  Tolerance: 1%  [RESC0402(1005)_N]
U26  QuadComp_Fairchild_LM339M  [QuadComp_Fairchild_LM339MX-NOPB_14SOIC]
U27  NMOS_Fairchild_FDV301  [NMOS_Fairchild_FDV301_SOT23-3]

### Ports
PG_ALL (bidir), PGOOD (harness PGOOD), PS_POR_B (bidir)

### Harnesses
PGOOD: PG0, PG1, PG2, PG3

### Nets
GND: C369.1 C370.1 D22.1(A) R228.1 R235.1 U26.12(GND) U27.S
VADJ: R230.1
VCC1V0: U26.5(IN1+)
VCC1V5: R234.1
VCC3V3: R229.2 R233.1 R236.2
VCC5V0: D20.1(K) D21.1(K) R231.2 R232.2 R237.2 U26.3(VCC)
PGOOD_ALL: C370.2 D21.2(A) R232.1 U26.1(OUT2) U26.9(IN3+) U27.G ; port PG_ALL
PGOOD_DDR: R230.2 R233.2 R234.2 R235.2 U26.7(IN2+) ; port PGOOD.PG1
PGOOD_VCC1V0: C369.2 D20.2(A) R231.1 U26.2(OUT1) ; port PGOOD.PG2
PS_POR_B: R229.1 U26.14(OUT3) ; port PS_POR_B
VREF_3V0: D22.3(K) R227.2 R237.1
NetLD4_1: LD4.1(K) U27.D
NetLD4_2: LD4.2(A) R236.1
NetR227_1: R227.1 R228.2 U26.4(IN1-) U26.6(IN2-)

Not connected (* = marked no-connect by the designer): U26 8(IN3-) 10(IN4-)* 11(IN4+)* 13(OUT4)*

### Library data of the parts
C369 = ECJ-0EB1E102K: as C358 on sheet Power_Regulators_Digital_4; Part Number: ECJ-0EB1E102K; Footprint Ref: CAPC0402(1005)60_N; Library Ref: CAP_0402
C370 = LMK105BJ224KV-F: 0.22uF, ceramic, 10% 10V X5R, 0402; Manufacturer: Taiyo Yuden; Part Number: LMK105BJ224KV-F; Footprint Ref: CAPC0402(1005)60_N; Library Ref: CAP_0402
D20 D21 = RB751S40: as D19 on sheet Power_Regulators_Digital_4; Part Number: RB751S40; Footprint Ref: SchottkyDiode_RB751S40_2-PIN; Library Ref: ShottkyDiode
D22 = BZX84-A3V0,215: BZX84-A3V0, VReg 250mW 3V, SOT23; Manufacturer: NXP Semiconductors; Part Number: BZX84-A3V0,215; Footprint Ref: ZenerDiode_BZX84-A3V0215_SOT23-3; Library Ref: ZenerDiode_BZX84-A3V0
LD4 = "HSMG-C190": LED 570NM GREEN DIFF 0603 SMD; Manufacturer: Avago; Value: "HSMG-C190 green"; Part Number: "HSMG-C190"; Footprint Ref: LED0603(1608); Library Ref: LED0603
R227 = MCR01MZPF1003: 100K ohm, 1%, 1/16W, 0402; Manufacturer: ROHM; Part Number: MCR01MZPF1003; Footprint Ref: RESC0402(1005)_N; Library Ref: RES_0402
R228 = ERJ-2RKF4302X: 43K ohm, 1% 1/10W, 0402; Manufacturer: Panasonic - ECG; Part Number: ERJ-2RKF4302X; Footprint Ref: RESC0402(1005)_N; Library Ref: RES_0402
R229 = RC0402JR-0710KL: as R199 on sheet Power_Regulators_Digital_1; Part Number: RC0402JR-0710KL; Footprint Ref: RESC0402(1005)_N; Library Ref: RES_0402
R230 R233 = RK73H1ETTP3302F: 33K ohms, 1% 1/16W, 0402; Manufacturer: KOA Speer Electronics; Part Number: RK73H1ETTP3302F; Footprint Ref: RESC0402(1005)_N; Library Ref: RES_0402
R231 R232 = RC0402JR-07100KL: 100K ohm, 5%, 1/16W, 0402; Manufacturer: Yageo America; Part Number: RC0402JR-07100KL; Footprint Ref: RESC0402(1005)_N; Library Ref: RES_0402
R234 = ERJ-2RKF1502X: 15K ohm, 1% 1/10W, 0402; Manufacturer: Panasonic - ECG; Part Number: ERJ-2RKF1502X; Footprint Ref: RESC0402(1005)_N; Library Ref: RES_0402
R235 = CRCW04029K76FKED: 9.76K ohm, 1% 1/16W, 0402; Manufacturer: Vishay/Dale; Part Number: CRCW04029K76FKED; Footprint Ref: RESC0402(1005)_N; Library Ref: RES_0402
R236 = ERJ-2RKF54R9X: RES 54.9 OHM 1/10W 1% 0402 SMD; Manufacturer: Panasonic Electronic Components; Tolerance: *; Part Number: ERJ-2RKF54R9X; Footprint Ref: RESC0402(1005)_N; Library Ref: RES_0402
R237 = CRCW0402402RFKED: 402 ohm, 1%, 1/16W, 0402; Manufacturer: Vishay/Dale; Part Number: CRCW0402402RFKED; Footprint Ref: RESC0402(1005)_N; Library Ref: RES_0402
U26 = LM339MX/NOPB: Quad Comparator,14-SOP; Part Number: LM339MX/NOPB; Manufacturer: Fairchild
U27 = FDV301N: MOSFET N-CH 25V 220MA SOT-23; Manufacturer: Fairchild Semiconductor; Part Number: FDV301N; Footprint Ref: NMOS_Fairchild_FDV301_SOT23-3; Library Ref: NMOS_Fairchild_FDV301

## Sheet Power_Regulators_Ether2V5.SchDoc
size A4; DocumentNumber: 39; SheetNumber: 39; SheetTotal: 47
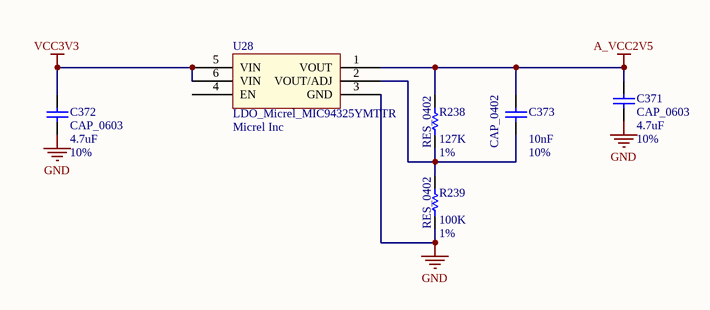
[diagram p37: Power_Regulators_Ether2V5.SchDoc]

### Parts
C371  CAP_0603  value 4.7uF  Tolerance: 10%  [CAPC0603(1608)100_N]
C372  CAP_0603  value 4.7uF  Tolerance: 10%  [CAPC0603(1608)100_N]
C373  CAP_0402  value 10nF  Tolerance: 10%  [CAPC0402(1005)60_N]
R238  RES_0402  value 127K  Tolerance: 1%  [RESC0402(1005)_N]
R239  RES_0402  value 100K  Tolerance: 1%  [RESC0402(1005)_N]
U28  LDO_Micrel_MIC94325YMTTR  Manufacturer: Micrel Inc  [LDO_Micrel_MIC94325YMTTR_TDFN-6]

### Nets
A_VCC2V5: C371.2 C373.2 R238.2 U28.1(VOUT)
GND: C371.1 C372.1 R239.1 U28.3(GND)
VCC3V3: C372.2 U28.5(VIN) U28.6(VIN)
NetC373_1: C373.1 R238.1 R239.2 U28.2(VOUT/ADJ)

Not connected (* = marked no-connect by the designer): U28 4(EN)

### Library data of the parts
C371 C372 = LMK107BJ475KA-T: 4.7uF, ceramic, 10%, 10V X5R, 0603; Manufacturer: Taiyo Yuden; Part Number: LMK107BJ475KA-T; Footprint Ref: CAPC0603(1608)100_N; Library Ref: CAP_0603
C373 = GRM155R60J103KA01D: 10000pF, ceramic, 10% 6.3V X5R, 0402; Manufacturer: Murata Electronics North America; Part Number: GRM155R60J103KA01D; Footprint Ref: CAPC0402(1005)60_N; Library Ref: CAP_0402
R238 = MCR01MZPF1273: 127K ohm, 1%, 1/16W, 0402; Manufacturer: ROHM; Part Number: MCR01MZPF1273; Footprint Ref: RESC0402(1005)_N; Library Ref: RES_0402
R239 = MCR01MZPF1003: 100K ohm, 1%, 1/16W, 0402; Manufacturer: ROHM; Part Number: MCR01MZPF1003; Footprint Ref: RESC0402(1005)_N; Library Ref: RES_0402
U28 = MIC94325YMTTR: IC REG LDO ADJ .5A 6TDFN; Part Number: MIC94325YMTTR; Footprint Ref: LDO_Micrel_MIC94325YMTTR_TDFN-6; Library Ref: LDO_Micrel_MIC94325YMTTR

## Sheet Power_Regulators_RF_2.SchDoc
size A4; DocumentNumber: 36; SheetNumber: 36; SheetTotal: 47
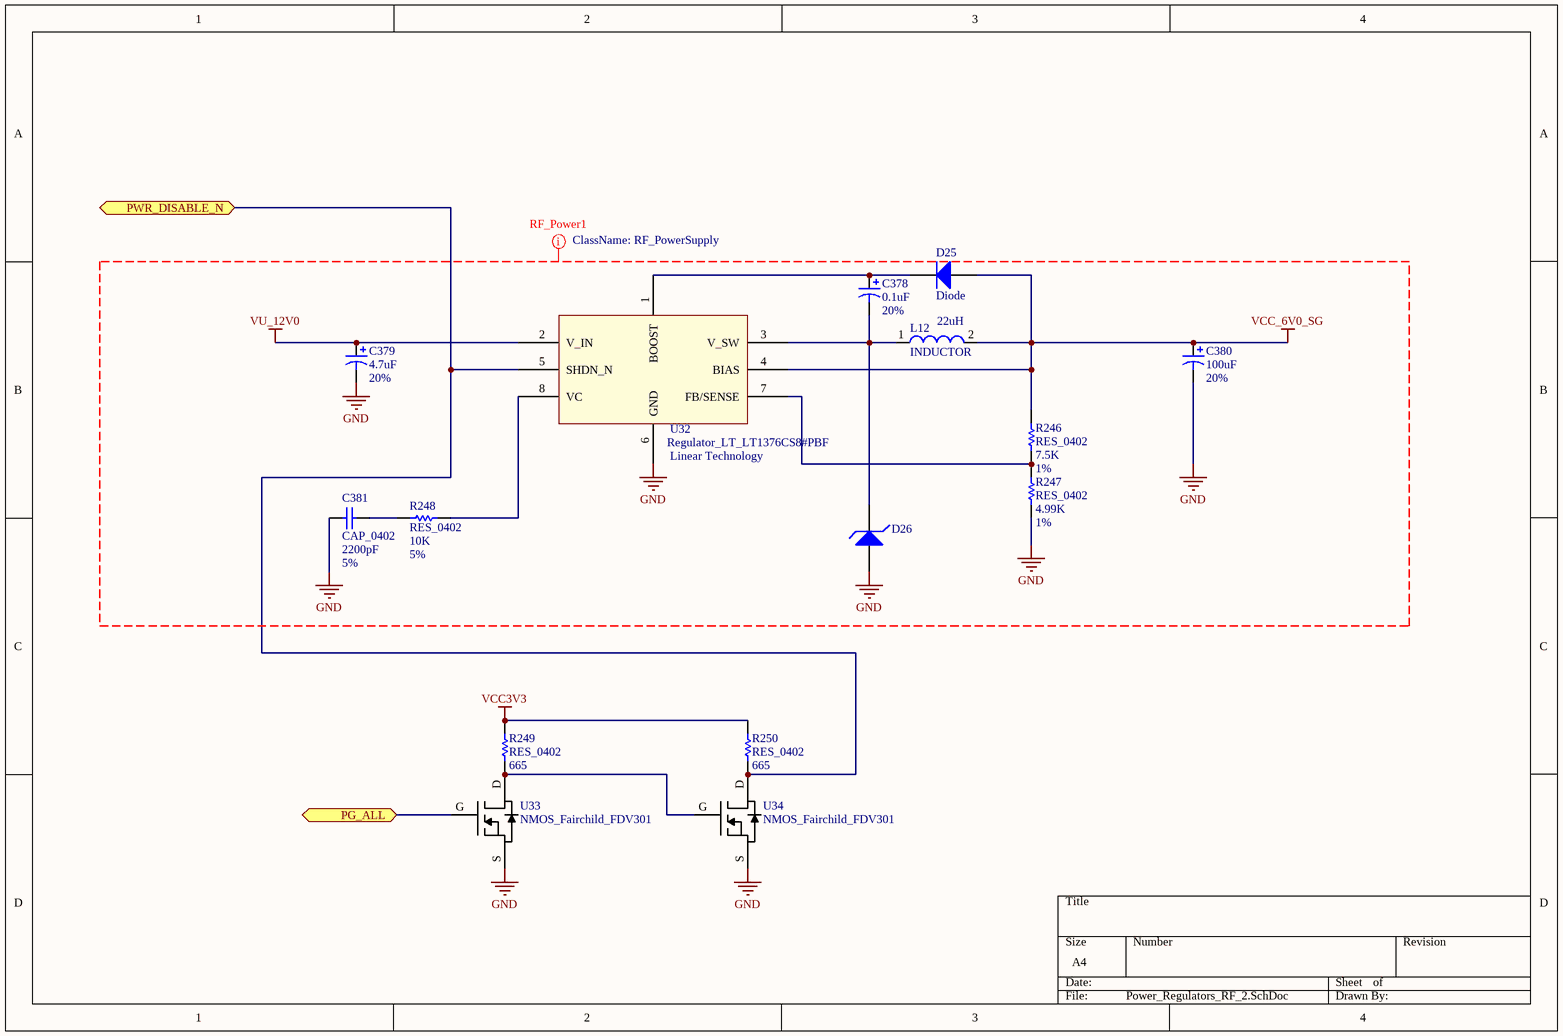
[diagram p38: Power_Regulators_RF_2.SchDoc]

### Parts
C378  value 0.1uF  Tolerance: 20%  [Polarized_CAPC1206(3216)]  (hidden comment: Cap Pol1)
C379  value 4.7uF  Tolerance: 20%  [Polarized_CAPC1206(3216)]  (hidden comment: Cap Pol1)
C380  value 100uF  Tolerance: 20%  [Polarized_CAPC1210(3225)]  (hidden comment: Cap Pol1)
C381  CAP_0402  value 2200pF  Tolerance: 5%  [CAPC0402(1005)60_N]
D25  Diode  [Diode_DB2J31700L_2-PIN]
D26  Shottky Diode  [SchottkyDiode_SS2P2-M384A_2-PIN]  (value not drawn)
L12  INDUCTOR  value 22uH  [Inductor_IHSM4825ER_2-PIN]
R246  RES_0402  value 7.5K  Tolerance: 1%  [RESC0402(1005)_N]
R247  RES_0402  value 4.99K  Tolerance: 1%  [RESC0402(1005)_N]
R248  RES_0402  value 10K  Tolerance: 5%  [RESC0402(1005)_N]
R249  RES_0402  value 665  [RESC0402(1005)_N]
R250  RES_0402  value 665  [RESC0402(1005)_N]
U32  Regulator_LT_LT1376CS8#PBF  Manufacturer: Linear Technology  [LT1376CS8#PBF_8SOIC]
U33  NMOS_Fairchild_FDV301  [NMOS_Fairchild_FDV301_SOT23-3]
U34  NMOS_Fairchild_FDV301  [NMOS_Fairchild_FDV301_SOT23-3]

### Ports
PG_ALL (bidir), PWR_DISABLE_N (bidir)

### Nets
GND: C379.2 C380.2 C381.1 D26.2(A) R247.1 U32.6(GND) U33.S U34.S
VCC3V3: R249.2 R250.2
VCC_6V0_SG: C380.1 D25.2(A) L12.2 R246.2 U32.4(BIAS)
VU_12V0: C379.1 U32.2(V_IN)
PGOOD_ALL: U33.G ; port PG_ALL
NetC378_1: C378.1 D25.1(K) U32.1(BOOST)
NetC378_2: C378.2 D26.1(K) L12.1 U32.3(V_SW)
NetC381_2: C381.2 R248.1
NetR195_2: R250.1 U32.5(SHDN_N) U34.D ; port PWR_DISABLE_N
NetR246_1: R246.1 R247.2 U32.7(FB/SENSE)
NetR248_2: R248.2 U32.8(VC)
NetR249_1: R249.1 U33.D U34.G

### Layout directives
net class RF_PowerSupply: GND, VCC_6V0_SG, VU_12V0

### Library data of the parts
C378 = T491A104M035AT: CAP TANT 0.1UF 35V 20% 1206; Manufacturer: Kemet; Part Number: T491A104M035AT; Footprint Ref: Polarized_CAPC1206(3216); Library Ref: Cap Pol1
C379 = T491A475M025AT: CAP TANT 4.7UF 25V 20% 1206; Manufacturer: Kemet; Part Number: T491A475M025AT; Footprint Ref: Polarized_CAPC1206(3216); Library Ref: Cap Pol1
C380 = TLCT107M010XTA: 100uF, tantalum, 20% 10V, 1210; Manufacturer: AVX Corporation; Part Number: TLCT107M010XTA; Footprint Ref: Polarized_CAPC1210(3225); Library Ref: Cap Pol1
C381 = C1005SL1A222J: CAP CER 2200PF 10V 5% SL 0402; Manufacturer: TDK Corporation; Part Number: C1005SL1A222J; Footprint Ref: CAPC0402(1005)60_N; Library Ref: CAP_0402
D25 = DB2J31700L: DIODE 30V 1A SMINI2; Manufacturer: Panasonic Electronic Components - Semiconductor Products; Part Number: DB2J31700L; Footprint Ref: Diode_DB2J31700L_2-PIN; Library Ref: Diode
D26 = SS2P2-M3/84A: DIODE SCHOTTKY 2A 20V SMP; Manufacturer: Vishay Semiconductor Diodes Division; Part Number: SS2P2-M3/84A; Footprint Ref: SchottkyDiode_SS2P2-M384A_2-PIN; Library Ref: ShottkyDiode
L12 = IHSM4825ER2R0L: Surface Mount Inductor,22uH,1.7A; Manufacturer: Vishay Dale; Tolerance: *; Part Number: IHSM4825ER2R0L; Footprint Ref: Inductor_IHSM4825ER_2-PIN; Library Ref: INDUCTOR
R246 = ERJ-2RKF7501X: RES 7.50K OHM 1/10W 1% 0402 SMD; Manufacturer: Panasonic Electronic Components; Part Number: ERJ-2RKF7501X; Footprint Ref: RESC0402(1005)_N; Library Ref: RES_0402
R247 = CRCW04024K99FKED: 4.99K ohm, 1% 1/16W, 0402; Manufacturer: Vishay/Dale; Part Number: CRCW04024K99FKED; Footprint Ref: RESC0402(1005)_N; Library Ref: RES_0402
R248 = RC0402JR-0710KL: 10K ohm, 5%, 1/16W, 0402; Manufacturer: Yageo America; Part Number: RC0402JR-0710KL; Footprint Ref: RESC0402(1005)_N; Library Ref: RES_0402
R249 R250 = ERJ-2RKF6650X: RES 665 OHM 1/10W 1% 0402 SMD; Manufacturer: Panasonic Electronic Components; Tolerance: *; Part Number: ERJ-2RKF6650X; Footprint Ref: RESC0402(1005)_N; Library Ref: RES_0402
U32 = LT1376CS8#PBF: IC REG BUCK ADJ 1.5A 8SOIC; Part Number: LT1376CS8#PBF; Footprint Ref: LT1376CS8#PBF_8SOIC; Library Ref: Regulator_LT_LT1376CS8#PBF
U33 U34 = FDV301N: MOSFET N-CH 25V 220MA SOT-23; Manufacturer: Fairchild Semiconductor; Part Number: FDV301N; Footprint Ref: NMOS_Fairchild_FDV301_SOT23-3; Library Ref: NMOS_Fairchild_FDV301

## Sheet Power_Regulators_RF_3.SchDoc
size A4; DocumentNumber: 37; SheetNumber: 37; SheetTotal: 47
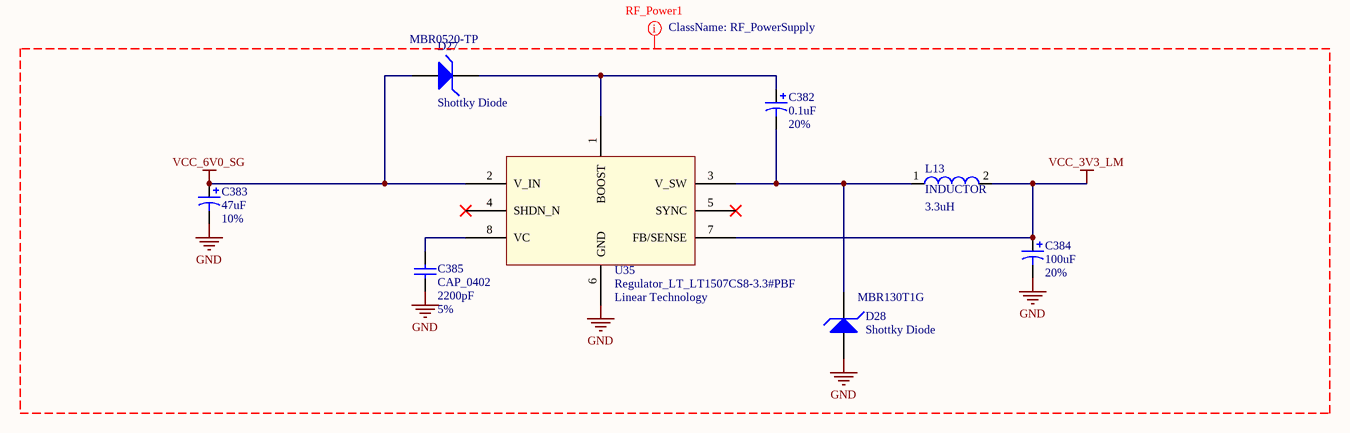
[diagram p39: Power_Regulators_RF_3.SchDoc]

### Parts
C382  value 0.1uF  Tolerance: 20%  [Polarized_CAPC1206(3216)]  (hidden comment: Cap Pol1)
C383  value 47uF  Tolerance: 10%  [Polarized_CAPC1210(3225)]  (hidden comment: Cap Pol1)
C384  value 100uF  Tolerance: 20%  [Polarized_CAPC1210(3225)]  (hidden comment: Cap Pol1)
C385  CAP_0402  value 2200pF  Tolerance: 5%  [CAPC0402(1005)60_N]
D27  Shottky Diode  Part Number: MBR0520-TP  [SchottkyDiode_MBR0520-TP_SOD-123]
D28  Shottky Diode  Part Number: MBR130T1G  [SchottkyDiode_MBR130T1G_SOD-123]
L13  INDUCTOR  value 3.3uH  [Inductor_IHSM4825ER_2-PIN]
U35  Regulator_LT_LT1507CS8-3.3#PBF  Manufacturer: Linear Technology  [Regulator_LT_LT1507CS8-3.3#PBF_8SOIC]

### Nets
GND: C383.2 C384.2 C385.1 D28.2(A) U35.6(GND)
VCC_3V3_LM: C384.1 L13.2 U35.7(FB/SENSE)
VCC_6V0_SG: C383.1 D27.2(A) U35.2(V_IN)
NetC382_1: C382.1 D27.1(K) U35.1(BOOST)
NetC382_2: C382.2 D28.1(K) L13.1 U35.3(V_SW)
NetC385_2: C385.2 U35.8(VC)

Not connected (* = marked no-connect by the designer): U35 4(SHDN_N)* 5(SYNC)*

### Layout directives
net class RF_PowerSupply: GND, VCC_3V3_LM, VCC_6V0_SG

### Library data of the parts
C382 = T491A104M035AT: as C378 on sheet Power_Regulators_RF_2; Part Number: T491A104M035AT; Footprint Ref: Polarized_CAPC1206(3216); Library Ref: Cap Pol1
C383 = F951C476KBAAQ2: CAP TANT 47UF 16V 10% 1210; Manufacturer: Nichicon; Part Number: F951C476KBAAQ2; Footprint Ref: Polarized_CAPC1210(3225); Library Ref: Cap Pol1
C384 = TLCT107M010XTA: as C380 on sheet Power_Regulators_RF_2; Part Number: TLCT107M010XTA; Footprint Ref: Polarized_CAPC1210(3225); Library Ref: Cap Pol1
C385 = C1005SL1A222J: as C381 on sheet Power_Regulators_RF_2; Part Number: C1005SL1A222J; Footprint Ref: CAPC0402(1005)60_N; Library Ref: CAP_0402
D27 = MBR0520-TP: DIODE SCHOTTKY 20V 500MA SOD123; Manufacturer: Micro Commercial Co; Footprint Ref: SchottkyDiode_MBR0520-TP_SOD-123; Library Ref: ShottkyDiode
D28 = MBR130T1G: DIODE SCHOTTKY 30V 1A SOD123; Manufacturer: ON Semiconductor; Footprint Ref: SchottkyDiode_MBR130T1G_SOD-123; Library Ref: ShottkyDiode
L13 = IHSM4825ER3R3L: INDUCTOR POWER 3.3UH 4.6A SMD; Manufacturer: Vishay Dale; Tolerance: *; Part Number: IHSM4825ER3R3L; Library Ref: INDUCTOR; Footprint Ref: Inductor_IHSM4825ER_2-PIN
U35 = LT1507CS8-3.3#PBF: IC REG BUCK 3.3V 1.5A 8SOIC; Part Number: LT1507CS8-3.3#PBF; Footprint Ref: Regulator_LT_LT1507CS8-3.3#PBF_8SOIC; Library Ref: Regulator_LT_LT1507CS8-3.3#PBF

## Sheet Power_Regulators_RF_4.SchDoc
size A4; DocumentNumber: 38; SheetNumber: 38; SheetTotal: 47
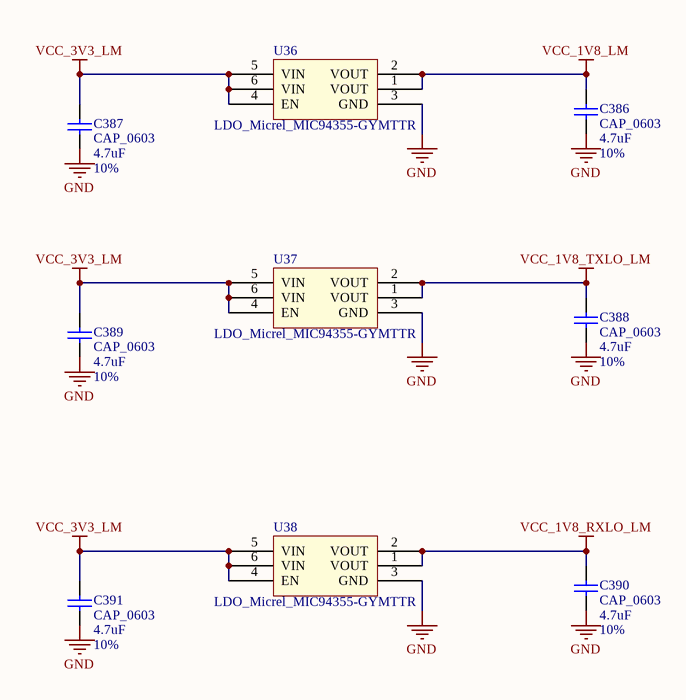
[diagram p40: Power_Regulators_RF_4.SchDoc]

### Parts
C386  CAP_0603  value 4.7uF  Tolerance: 10%  [CAPC0603(1608)100_N]
C387  CAP_0603  value 4.7uF  Tolerance: 10%  [CAPC0603(1608)100_N]
C388  CAP_0603  value 4.7uF  Tolerance: 10%  [CAPC0603(1608)100_N]
C389  CAP_0603  value 4.7uF  Tolerance: 10%  [CAPC0603(1608)100_N]
C390  CAP_0603  value 4.7uF  Tolerance: 10%  [CAPC0603(1608)100_N]
C391  CAP_0603  value 4.7uF  Tolerance: 10%  [CAPC0603(1608)100_N]
U36  LDO_Micrel_MIC94355-GYMTTR  [LDO_Micrel_MIC94325YMTTR_TDFN-6]
U37  LDO_Micrel_MIC94355-GYMTTR  [LDO_Micrel_MIC94325YMTTR_TDFN-6]
U38  LDO_Micrel_MIC94355-GYMTTR  [LDO_Micrel_MIC94325YMTTR_TDFN-6]

### Nets
GND: C386.1 C387.1 C388.1 C389.1 C390.1 C391.1 U36.3(GND) U37.3(GND) U38.3(GND)
VCC_1V8_LM: C386.2 U36.1(VOUT) U36.2(VOUT)
VCC_1V8_RXLO_LM: C390.2 U38.1(VOUT) U38.2(VOUT)
VCC_1V8_TXLO_LM: C388.2 U37.1(VOUT) U37.2(VOUT)
VCC_3V3_LM: C387.2 C389.2 C391.2 U36.4(EN) U36.5(VIN) U36.6(VIN) U37.4(EN) U37.5(VIN) U37.6(VIN) U38.4(EN) U38.5(VIN) U38.6(VIN)

### Library data of the parts
C386-C391 = LMK107BJ475KA-T: as C371 on sheet Power_Regulators_Ether2V5; Part Number: LMK107BJ475KA-T; Footprint Ref: CAPC0603(1608)100_N; Library Ref: CAP_0603
U36-U38 = LDO_Micrel_MIC94355-GYMTTR: IC REG LDO 1.8V .5A 6TDFN; Manufacturer: Micrel Inc; Footprint Ref: LDO_Micrel_MIC94325YMTTR_TDFN-6; Library Ref: LDO_Micrel_MIC94355-GYMTTR; Part Number: MIC94355-GYMT TR

## Sheet Shundown_Mechanism.SchDoc
size A4
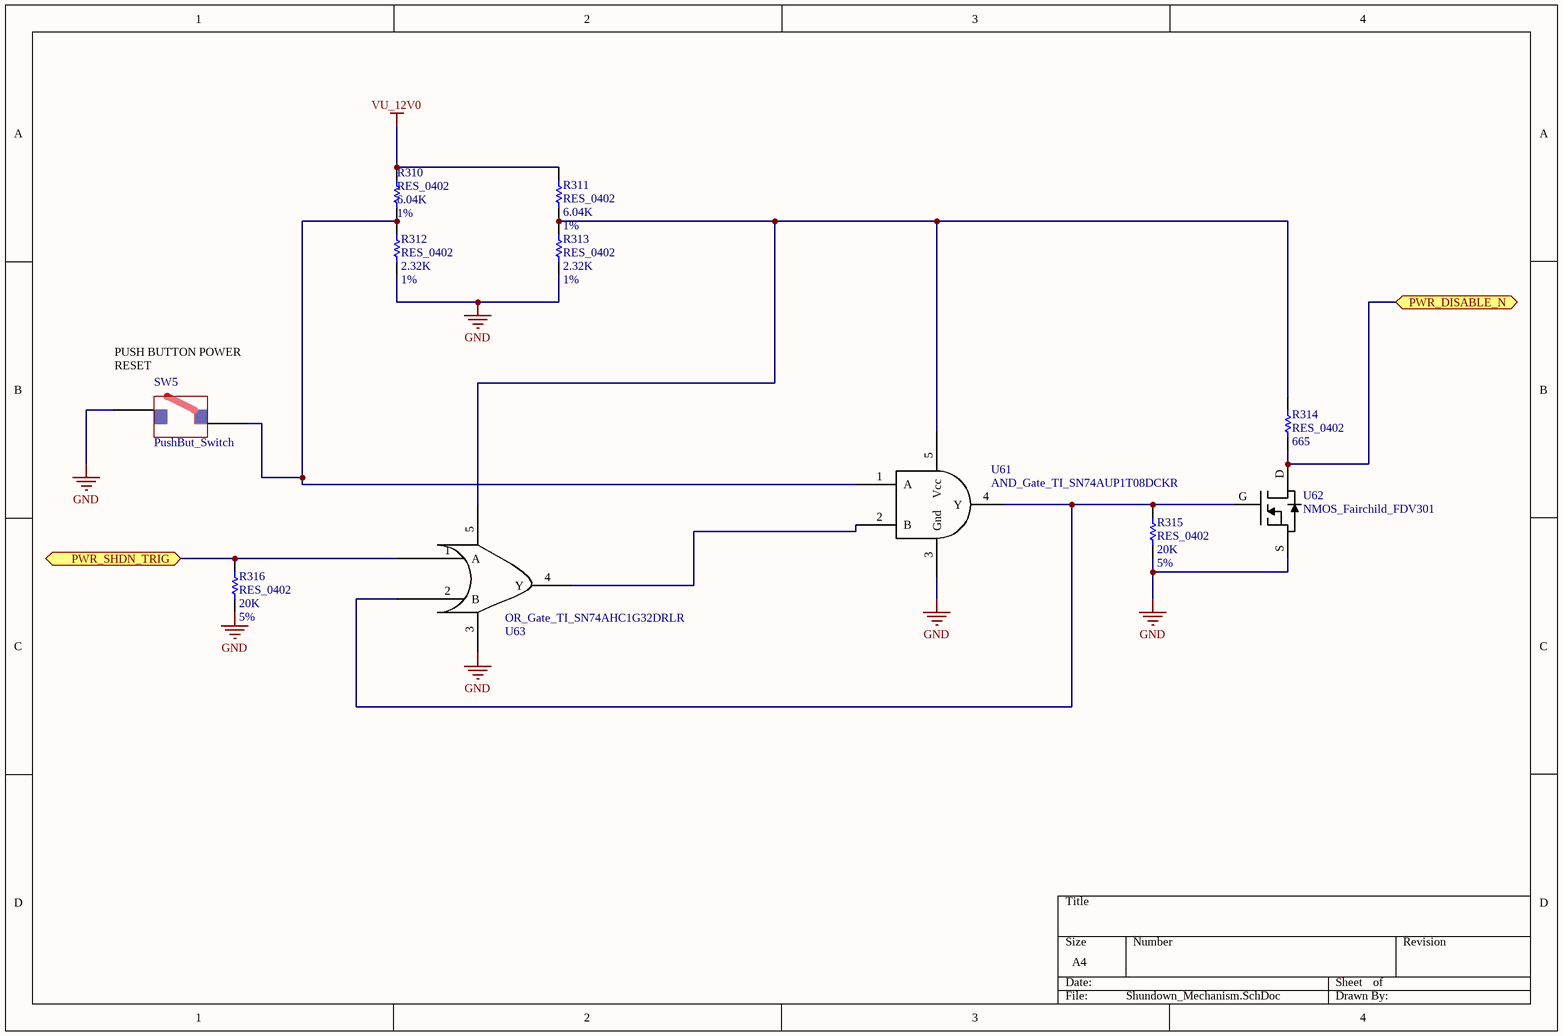
[diagram p41: Shundown_Mechanism.SchDoc]

### Parts
R310  RES_0402  value 6.04K  Tolerance: 1%  [RESC0402(1005)_N]
R311  RES_0402  value 6.04K  Tolerance: 1%  [RESC0402(1005)_N]
R312  RES_0402  value 2.32K  Tolerance: 1%  [RESC0402(1005)_N]
R313  RES_0402  value 2.32K  Tolerance: 1%  [RESC0402(1005)_N]
R314  RES_0402  value 665  [RESC0402(1005)_N]
R315  RES_0402  value 20K  Tolerance: 5%  [RESC0402(1005)_N]
R316  RES_0402  value 20K  Tolerance: 5%  [RESC0402(1005)_N]
SW5  PushBut_Switch  [PushButtonSwitch_CnK_1.14002.1110000]
U61  AND_Gate_TI_SN74AUP1T08DCKR  [AND_Gate_TI_SN74AUP1T08DCKR_SC70-5]
U62  NMOS_Fairchild_FDV301  [NMOS_Fairchild_FDV301_SOT23-3]
U63  OR_Gate_TI_SN74AHC1G32DRLR  [OR_Gate_TI_SN74AHC1G32DRLR_DRL-5]

### Ports
PWR_DISABLE_N (bidir), PWR_SHDN_TRIG

### Nets
GND: R312.1 R313.1 R315.1 R316.1 SW5.3 U61.3(Gnd) U62.S U63.3
VU_12V0: R310.2 R311.2
NetR195_2: R314.1 U62.D ; port PWR_DISABLE_N
NetR310_1: R310.1 R312.2 SW5.4 U61.1(A)
NetR311_1: R311.1 R313.2 R314.2 U61.5(Vcc) U63.5
NetR315_2: R315.2 U61.4(Y) U62.G U63.2(B)
NetR316_2: R316.2 U63.1(A) ; port PWR_SHDN_TRIG
NetU61_2: U61.2(B) U63.4(Y)

### Notes on the sheet
- (near SW5) PUSH BUTTON POWER RESET

### Library data of the parts
R310 R311 = ERJ-2RKF6041X: RES 6.04K OHM 1/10W 1% 0402 SMD; Manufacturer: Panasonic Electronic Components; Part Number: ERJ-2RKF6041X
R312 R313 = ERJ-2RKF2321X: 2.32K ohm, 1% 1/16W, 0402; Manufacturer: Panasonic - ECG; Part Number: ERJ-2RKF2321X
R314 = ERJ-2RKF6650X: as R249 on sheet Power_Regulators_RF_2; Tolerance: *; Part Number: ERJ-2RKF6650X; Footprint Ref: RESC0402(1005)_N; Library Ref: RES_0402
R315 R316 = RES_0402: 20K ohm, 5%, 1/16W, 0402; Part Number: ERJ-2GEJ203X; Manufacturer: Panasonic - ECG; Library Ref: RES_0402; Footprint Ref: RESC0402(1005)_N
SW5 = 1.14002.1110000: SWITCH PUSH SPST-NO 0.1A 35V; Manufacturer: C&K Components; Part Number: 1.14002.1110000
U61 = SN74AUP1T08DCKR: IC GATE POS-AND SLG 2INP SC70-5; Manufacturer: Texas Instruments; Part Number: SN74AUP1T08DCKR
U62 = FDV301N: as U33 on sheet Power_Regulators_RF_2; Part Number: FDV301N; Footprint Ref: NMOS_Fairchild_FDV301_SOT23-3; Library Ref: NMOS_Fairchild_FDV301
U63 = SN74AHC1G32DRLR: IC SNGL 2-IN POS-OR GATE SOT-5; Manufacturer: Texas Instruments; Part Number: SN74AHC1G32DRLR